# Altium project UCLA-DRS4-2.1.PrjPCB (part 4 of 7)

## Sheet TCA_CLK_DIST.SchDoc: My title
size A3; Organization: University of California; Address1: 475 Portola Plaza; Address2: Los Angeles, CA 90095; Revision: R01; SheetNumber: 1; SheetTotal: 1
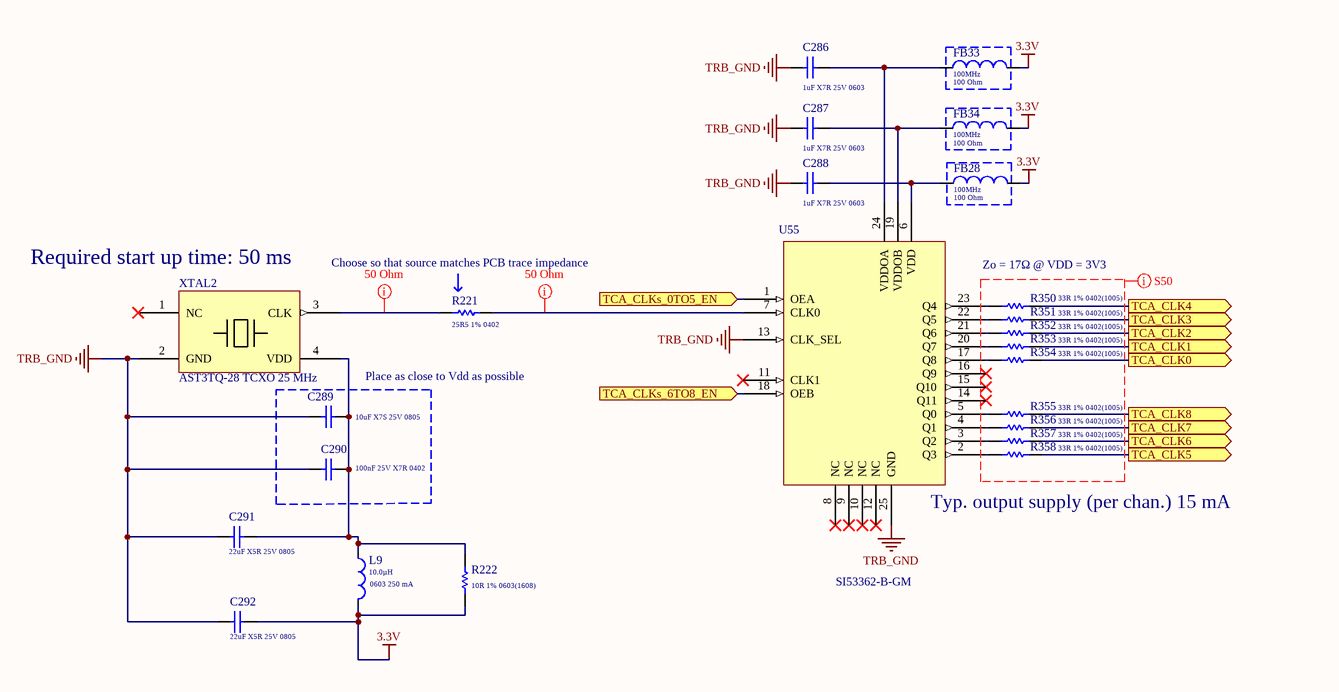
[diagram p11: TCA_CLK_DIST.SchDoc]

### Parts
C286  Capacitance: 1uF X7R 25V 0603  [Cap_Murata_GCJ188R71E105KA01J_1uF]  (hidden comment: Cap_Murata_GCJ188R71E105KA01J_1uF)
C287  Capacitance: 1uF X7R 25V 0603  [Cap_Murata_GCJ188R71E105KA01J_1uF]  (hidden comment: Cap_Murata_GCJ188R71E105KA01J_1uF)
C288  Capacitance: 1uF X7R 25V 0603  [Cap_Murata_GCJ188R71E105KA01J_1uF]  (hidden comment: Cap_Murata_GCJ188R71E105KA01J_1uF)
C289  Capacitance: 10uF X7S 25V 0805  [Cap_Murata_ GRM21BC71E106ME11L_10uF]  (hidden comment: Cap_Murata_ GRM21BC71E106ME11L_10uF)
C290  Capacitance: 100nF 25V X7R 0402  [Cap_Taiyo_Yuden_TMK105B7104KV-FR_100nF]  (hidden comment: Cap_Taiyo_Yuden_TMK105B7104KV-FR_100nF)
C291  Capacitance: 22uF X5R 25V 0805  [Cap_Murata_GRT21BR61E226ME13L_22uF]  (hidden comment: Cap_Murata_GRT21BR61E226ME13L_22uF)
C292  Capacitance: 22uF X5R 25V 0805  [Cap_Murata_GRT21BR61E226ME13L_22uF]  (hidden comment: Cap_Murata_GRT21BR61E226ME13L_22uF)
FB28  Measuring Frequency: 100MHz  Impedance: 100 Ohm  [FB_Wurth_Electronics_742792731_100Ohms]  (hidden comment: 742792731)
FB33  Measuring Frequency: 100MHz  Impedance: 100 Ohm  [FB_Wurth_Electronics_742792731_100Ohms]  (hidden comment: 742792731)
FB34  Measuring Frequency: 100MHz  Impedance: 100 Ohm  [FB_Wurth_Electronics_742792731_100Ohms]  (hidden comment: 742792731)
L9  0603 250 mA  Inductance: 10.0µH  [TDK_MLZ1608M100WT_0]
R221  25R5 1% 0402  [RESC0402(1005)_L]
R222  10R 1% 0603(1608)  [RESC0603(1608)_L]
R350  33R 1% 0402(1005)  [RESC0402(1005)_L]
R351  33R 1% 0402(1005)  [RESC0402(1005)_L]
R352  33R 1% 0402(1005)  [RESC0402(1005)_L]
R353  33R 1% 0402(1005)  [RESC0402(1005)_L]
R354  33R 1% 0402(1005)  [RESC0402(1005)_L]
R355  33R 1% 0402(1005)  [RESC0402(1005)_L]
R356  33R 1% 0402(1005)  [RESC0402(1005)_L]
R357  33R 1% 0402(1005)  [RESC0402(1005)_L]
R358  33R 1% 0402(1005)  [RESC0402(1005)_L]
U55  SI53362-B-GM  [Si53362]
XTAL2  AST3TQ-28 TCXO 25 MHz  [XTAL_ASDM1-25.000MHZ-LC-T]

### Blocks framed on the sheet
Place as close to Vdd as possible: C289 C290

### Ports
TCA_CLK0 (out), TCA_CLK1 (out), TCA_CLK2 (out), TCA_CLK3 (out), TCA_CLK4 (out), TCA_CLK5 (out), TCA_CLK6 (out), TCA_CLK7 (out), TCA_CLK8 (out), TCA_CLKs_0TO5_EN (in), TCA_CLKs_6TO8_EN (in)

### Nets
3.3V: C292.2 FB28.2 FB33.2 FB34.2 L9.2 R222.1
TRB_GND: C286.2 C287.2 C288.2 C289.1 C290.2 C291.1 C292.1 U55.13(CLK_SEL) U55.25(GND) XTAL2.2(GND)
TCA_CLK0: R354.2 ; port TCA_CLK0
TCA_CLK1: R353.2 ; port TCA_CLK1
TCA_CLK2: R352.2 ; port TCA_CLK2
TCA_CLK3: R351.2 ; port TCA_CLK3
TCA_CLK4: R350.2 ; port TCA_CLK4
TCA_CLK5: R358.2 ; port TCA_CLK5
TCA_CLK6: R357.2 ; port TCA_CLK6
TCA_CLK7: R356.2 ; port TCA_CLK7
TCA_CLK8: R355.2 ; port TCA_CLK8
TCA_CLK_0T05_EN: U55.1(OEA) ; port TCA_CLKs_0TO5_EN
TCA_CLK_6T08_EN: U55.18(OEB) ; port TCA_CLKs_6TO8_EN
NetC286_1: C286.1 FB33.1 U55.24(VDDOA)
NetC287_1: C287.1 FB34.1 U55.19(VDDOB)
NetC288_1: C288.1 FB28.1 U55.6(VDD)
NetC289_2: C289.2 C290.1 C291.2 L9.1 R222.2 XTAL2.4(VDD)
NetR221_1: R221.1 XTAL2.3(CLK)
NetR221_2: R221.2 U55.7(CLK0)
NetR350_1: R350.1 U55.23(Q4)
NetR351_1: R351.1 U55.22(Q5)
NetR352_1: R352.1 U55.21(Q6)
NetR353_1: R353.1 U55.20(Q7)
NetR354_1: R354.1 U55.17(Q8)
NetR355_1: R355.1 U55.5(Q0)
NetR356_1: R356.1 U55.4(Q1)
NetR357_1: R357.1 U55.3(Q2)
NetR358_1: R358.1 U55.2(Q3)

Not connected (* = marked no-connect by the designer): U55 8(NC)* 9(NC)* 10(NC)* 11(CLK1)* 12(NC)* 14(Q11)* 15(Q10)* 16(Q9)*; XTAL2 1(NC)*

### Layout directives
net class S50: (no net found under the mark)

### Notes on the sheet
- (near XTAL2) Required start up time: 50 ms
- Choose so that source matches PCB trace impedance
- Zo = 17Ω @ VDD = 3V3
- (near U55) Typ. output supply (per chan.) 15 mA
- 475 Portola Plaza
- GAPS TOF
- igarcia91@g.ucla.edu
- Los Angeles, CA
- 310-825-0344
- Size:
- Date:
- Letter
- Number:
- Time:
- Sheet
- Revision:
- of
- andrew.peck@cern.ch
- spq@ucla.edu
- File:

### Library data of the parts
C286-C288 = Cap_Murata_GCJ188R71E105KA01J_1uF: CAP CER 1uF 25V X7R 0603; Supplier 1: Mouser; Supplier Part Number 1: 81-GCJ188R71E105KA1J
C289 = Cap_Murata_ GRM21BC71E106ME11L_10uF: CAP CER 10uF 25V X7R 0805; Supplier 1: Mouser; Supplier Part Number 1: 81-GRM21BC71E106ME1L
C290 = Cap_Taiyo_Yuden_TMK105B7104KV-FR_100nF: CAP CER 100nF 25V X7R 0402; Supplier 1: Mouser; Supplier Part Number 1: 963-TMK105B7104KV-FR
C291 C292 = Cap_Murata_GRT21BR61E226ME13L_22uF: CAP CER 22uF 25V X5R 0805; Supplier 1: Mouser; Supplier Part Number 1: 81-GRT21BR61E226ME3L
FB28 FB33 FB34 = FB_Wurth_Electronics_742792731_100Ohms: FB SMD 100 OHM 25% 1.2A 0402; DC Resistance: 90mOhm; Supplier 1: Mouser; Supplier Part Number 1: 710-742792731
L9 = Ind_TDK_MLZ1608M100WT_eec: IND 10µH Shielded Multilayer Inductor 250mA 1.365 Ohm Max 0603 (1608 Metric); Manufacturer: TDK; Value: 10.0µH; Tolerance: ±20%; Part Number: MLZ1608M100WT; helpURL: https://upverter.com/upn/revision/22fa022ced0eb0ec/; ComponentLink2Description: Datasheet; Temperature: -55°C to +125°C; Package: 0603 (1608 metric); Supplier 2: Mouser; Supplier 1: Digi-Key; ComponentLink1URL: https://upverter.com/upn/revision/22fa022ced0eb0ec/; Supplier Part Number 2: 810-MLZ1608M100WT000; Supplier Part Number 1: 445-6389-1-ND; ComponentLink1Description: Upverter; ComponentLink2URL: https://product.tdk.com/info/en/catalog/datasheets/inductor_commercial_decoupling_mlz1608_en.pdf; RoHS: TRUE; Mouser Part Number: 810-MLZ1608M100WT000; Current Rating: 250mA; Ipc Land Pattern Name: CAPC16080X45; Temperature Range High: +125°C; Digikey Description: IND 10µH Shielded Multilayer Inductor 250mA 1.365 Ohm Max 0603 (1608 Metric); Digikey Part Number: 445-6389-1-ND; Lead Free: yes; Temperature Range Low: -55°C; DC Resistance (DCR): 1.365 Ohm Max
R221 = CMP-1011-00328-1: 25R5 0.063W 1% 0402 (1005 Metric)  SMD; Case-EIA: 0402; Case-Metric: 1005; Value: 25.50 Ohm; Tolerance: 1 %; Power: 0.063 W; Technology: SMT
R222 = CMP-1012-00284-1: 10R 0.1W 1% 0603 (1608 Metric)  SMD; Case-Metric: 1608; Case-EIA: 0603; Value: 10.00 Ohm; Tolerance: 1 %; Power: 0.1 W; Technology: SMT
R350-R358 = CMP-1011-00341-1: 33R 0.063W 1% 0402 (1005 Metric)  SMD; Case-Metric: 1005; Value: 33.00 Ohm; Case-EIA: 0402; Tolerance: 1 %; Power: 0.063 W; Technology: SMT
U55 = SI53362-B-GM: Clock Buffer LVCMOS 2:12 buffer (200MHz), 2:1 LVCMOS input max, output enable (QFN24); Supplier 1: Mouser; Supplier Part Number 1: 634-SI53362-B-GM
XTAL2 = AST3TQ-28: TCXO Oscillators 25MHz 3.3Volt LVCMOS 0.280 ppm -40C 85C; Supplier 1: Mouser; Supplier Part Number 1: 815-3TQ-T40-28

## Sheet TCA_LP_FILTER.SchDoc: My title
size A3; Organization: University of California; Address1: 475 Portola Plaza; Address2: Los Angeles, CA 90095; Revision: R01; SheetNumber: 1; SheetTotal: 1
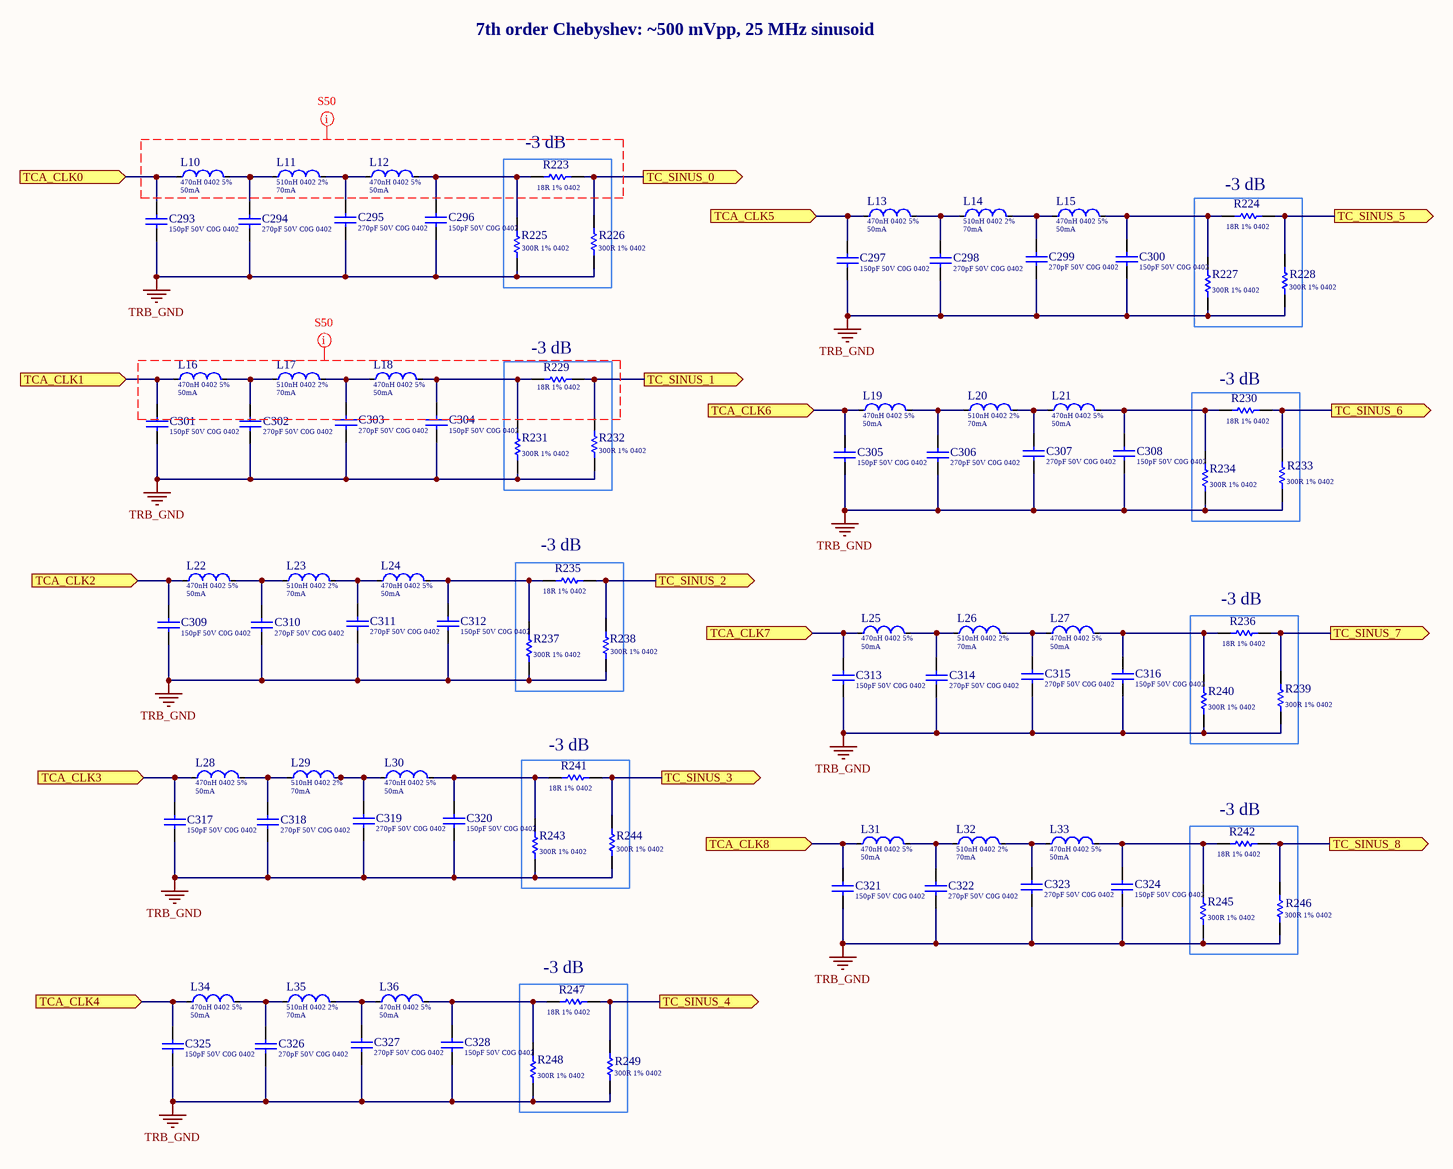
[diagram p12: TCA_LP_FILTER.SchDoc]

### Parts
C293  Capacitance: 150pF 50V C0G 0402  [Cap_TDK_CGA2B2C0G2A151J050BE_150pF]  (hidden comment: Cap_TDK_CGA2B2C0G2A151J050BE_150pF)
C294  Capacitance: 270pF 50V C0G 0402  [Cap_Murata_GCM1555C1H271FA16D_270pF]  (hidden comment: Cap_Murata_GCM1555C1H271FA16D_270pF)
C295  Capacitance: 270pF 50V C0G 0402  [Cap_Murata_GCM1555C1H271FA16D_270pF]  (hidden comment: Cap_Murata_GCM1555C1H271FA16D_270pF)
C296  Capacitance: 150pF 50V C0G 0402  [Cap_TDK_CGA2B2C0G2A151J050BE_150pF]  (hidden comment: Cap_TDK_CGA2B2C0G2A151J050BE_150pF)
C297  Capacitance: 150pF 50V C0G 0402  [Cap_TDK_CGA2B2C0G2A151J050BE_150pF]  (hidden comment: Cap_TDK_CGA2B2C0G2A151J050BE_150pF)
C298  Capacitance: 270pF 50V C0G 0402  [Cap_Murata_GCM1555C1H271FA16D_270pF]  (hidden comment: Cap_Murata_GCM1555C1H271FA16D_270pF)
C299  Capacitance: 270pF 50V C0G 0402  [Cap_Murata_GCM1555C1H271FA16D_270pF]  (hidden comment: Cap_Murata_GCM1555C1H271FA16D_270pF)
C300  Capacitance: 150pF 50V C0G 0402  [Cap_TDK_CGA2B2C0G2A151J050BE_150pF]  (hidden comment: Cap_TDK_CGA2B2C0G2A151J050BE_150pF)
C301  Capacitance: 150pF 50V C0G 0402  [Cap_TDK_CGA2B2C0G2A151J050BE_150pF]  (hidden comment: Cap_TDK_CGA2B2C0G2A151J050BE_150pF)
C302  Capacitance: 270pF 50V C0G 0402  [Cap_Murata_GCM1555C1H271FA16D_270pF]  (hidden comment: Cap_Murata_GCM1555C1H271FA16D_270pF)
C303  Capacitance: 270pF 50V C0G 0402  [Cap_Murata_GCM1555C1H271FA16D_270pF]  (hidden comment: Cap_Murata_GCM1555C1H271FA16D_270pF)
C304  Capacitance: 150pF 50V C0G 0402  [Cap_TDK_CGA2B2C0G2A151J050BE_150pF]  (hidden comment: Cap_TDK_CGA2B2C0G2A151J050BE_150pF)
C305  Capacitance: 150pF 50V C0G 0402  [Cap_TDK_CGA2B2C0G2A151J050BE_150pF]  (hidden comment: Cap_TDK_CGA2B2C0G2A151J050BE_150pF)
C306  Capacitance: 270pF 50V C0G 0402  [Cap_Murata_GCM1555C1H271FA16D_270pF]  (hidden comment: Cap_Murata_GCM1555C1H271FA16D_270pF)
C307  Capacitance: 270pF 50V C0G 0402  [Cap_Murata_GCM1555C1H271FA16D_270pF]  (hidden comment: Cap_Murata_GCM1555C1H271FA16D_270pF)
C308  Capacitance: 150pF 50V C0G 0402  [Cap_TDK_CGA2B2C0G2A151J050BE_150pF]  (hidden comment: Cap_TDK_CGA2B2C0G2A151J050BE_150pF)
C309  Capacitance: 150pF 50V C0G 0402  [Cap_TDK_CGA2B2C0G2A151J050BE_150pF]  (hidden comment: Cap_TDK_CGA2B2C0G2A151J050BE_150pF)
C310  Capacitance: 270pF 50V C0G 0402  [Cap_Murata_GCM1555C1H271FA16D_270pF]  (hidden comment: Cap_Murata_GCM1555C1H271FA16D_270pF)
C311  Capacitance: 270pF 50V C0G 0402  [Cap_Murata_GCM1555C1H271FA16D_270pF]  (hidden comment: Cap_Murata_GCM1555C1H271FA16D_270pF)
C312  Capacitance: 150pF 50V C0G 0402  [Cap_TDK_CGA2B2C0G2A151J050BE_150pF]  (hidden comment: Cap_TDK_CGA2B2C0G2A151J050BE_150pF)
C313  Capacitance: 150pF 50V C0G 0402  [Cap_TDK_CGA2B2C0G2A151J050BE_150pF]  (hidden comment: Cap_TDK_CGA2B2C0G2A151J050BE_150pF)
C314  Capacitance: 270pF 50V C0G 0402  [Cap_Murata_GCM1555C1H271FA16D_270pF]  (hidden comment: Cap_Murata_GCM1555C1H271FA16D_270pF)
C315  Capacitance: 270pF 50V C0G 0402  [Cap_Murata_GCM1555C1H271FA16D_270pF]  (hidden comment: Cap_Murata_GCM1555C1H271FA16D_270pF)
C316  Capacitance: 150pF 50V C0G 0402  [Cap_TDK_CGA2B2C0G2A151J050BE_150pF]  (hidden comment: Cap_TDK_CGA2B2C0G2A151J050BE_150pF)
C317  Capacitance: 150pF 50V C0G 0402  [Cap_TDK_CGA2B2C0G2A151J050BE_150pF]  (hidden comment: Cap_TDK_CGA2B2C0G2A151J050BE_150pF)
C318  Capacitance: 270pF 50V C0G 0402  [Cap_Murata_GCM1555C1H271FA16D_270pF]  (hidden comment: Cap_Murata_GCM1555C1H271FA16D_270pF)
C319  Capacitance: 270pF 50V C0G 0402  [Cap_Murata_GCM1555C1H271FA16D_270pF]  (hidden comment: Cap_Murata_GCM1555C1H271FA16D_270pF)
C320  Capacitance: 150pF 50V C0G 0402  [Cap_TDK_CGA2B2C0G2A151J050BE_150pF]  (hidden comment: Cap_TDK_CGA2B2C0G2A151J050BE_150pF)
C321  Capacitance: 150pF 50V C0G 0402  [Cap_TDK_CGA2B2C0G2A151J050BE_150pF]  (hidden comment: Cap_TDK_CGA2B2C0G2A151J050BE_150pF)
C322  Capacitance: 270pF 50V C0G 0402  [Cap_Murata_GCM1555C1H271FA16D_270pF]  (hidden comment: Cap_Murata_GCM1555C1H271FA16D_270pF)
C323  Capacitance: 270pF 50V C0G 0402  [Cap_Murata_GCM1555C1H271FA16D_270pF]  (hidden comment: Cap_Murata_GCM1555C1H271FA16D_270pF)
C324  Capacitance: 150pF 50V C0G 0402  [Cap_TDK_CGA2B2C0G2A151J050BE_150pF]  (hidden comment: Cap_TDK_CGA2B2C0G2A151J050BE_150pF)
C325  Capacitance: 150pF 50V C0G 0402  [Cap_TDK_CGA2B2C0G2A151J050BE_150pF]  (hidden comment: Cap_TDK_CGA2B2C0G2A151J050BE_150pF)
C326  Capacitance: 270pF 50V C0G 0402  [Cap_Murata_GCM1555C1H271FA16D_270pF]  (hidden comment: Cap_Murata_GCM1555C1H271FA16D_270pF)
C327  Capacitance: 270pF 50V C0G 0402  [Cap_Murata_GCM1555C1H271FA16D_270pF]  (hidden comment: Cap_Murata_GCM1555C1H271FA16D_270pF)
C328  Capacitance: 150pF 50V C0G 0402  [Cap_TDK_CGA2B2C0G2A151J050BE_150pF]  (hidden comment: Cap_TDK_CGA2B2C0G2A151J050BE_150pF)
L10  470nH 0402 5%  Current Rating: 50mA  [TDK_MLF1005GR47JT000_0]
L11  510nH 0402 2%  Current Rating: 70mA  [TDK_MHQ1005PR51GT000_0]
L12  470nH 0402 5%  Current Rating: 50mA  [TDK_MLF1005GR47JT000_0]
L13  470nH 0402 5%  Current Rating: 50mA  [TDK_MLF1005GR47JT000_0]
L14  510nH 0402 2%  Current Rating: 70mA  [TDK_MHQ1005PR51GT000_0]
L15  470nH 0402 5%  Current Rating: 50mA  [TDK_MLF1005GR47JT000_0]
L16  470nH 0402 5%  Current Rating: 50mA  [TDK_MLF1005GR47JT000_0]
L17  510nH 0402 2%  Current Rating: 70mA  [TDK_MHQ1005PR51GT000_0]
L18  470nH 0402 5%  Current Rating: 50mA  [TDK_MLF1005GR47JT000_0]
L19  470nH 0402 5%  Current Rating: 50mA  [TDK_MLF1005GR47JT000_0]
L20  510nH 0402 2%  Current Rating: 70mA  [TDK_MHQ1005PR51GT000_0]
L21  470nH 0402 5%  Current Rating: 50mA  [TDK_MLF1005GR47JT000_0]
L22  470nH 0402 5%  Current Rating: 50mA  [TDK_MLF1005GR47JT000_0]
L23  510nH 0402 2%  Current Rating: 70mA  [TDK_MHQ1005PR51GT000_0]
L24  470nH 0402 5%  Current Rating: 50mA  [TDK_MLF1005GR47JT000_0]
L25  470nH 0402 5%  Current Rating: 50mA  [TDK_MLF1005GR47JT000_0]
L26  510nH 0402 2%  Current Rating: 70mA  [TDK_MHQ1005PR51GT000_0]
L27  470nH 0402 5%  Current Rating: 50mA  [TDK_MLF1005GR47JT000_0]
L28  470nH 0402 5%  Current Rating: 50mA  [TDK_MLF1005GR47JT000_0]
L29  510nH 0402 2%  Current Rating: 70mA  [TDK_MHQ1005PR51GT000_0]
L30  470nH 0402 5%  Current Rating: 50mA  [TDK_MLF1005GR47JT000_0]
L31  470nH 0402 5%  Current Rating: 50mA  [TDK_MLF1005GR47JT000_0]
L32  510nH 0402 2%  Current Rating: 70mA  [TDK_MHQ1005PR51GT000_0]
L33  470nH 0402 5%  Current Rating: 50mA  [TDK_MLF1005GR47JT000_0]
L34  470nH 0402 5%  Current Rating: 50mA  [TDK_MLF1005GR47JT000_0]
L35  510nH 0402 2%  Current Rating: 70mA  [TDK_MHQ1005PR51GT000_0]
L36  470nH 0402 5%  Current Rating: 50mA  [TDK_MLF1005GR47JT000_0]
R223  18R 1% 0402  [RESC0402(1005)_L]
R224  18R 1% 0402  [RESC0402(1005)_L]
R225  300R 1% 0402  [RESC0402(1005)_L]
R226  300R 1% 0402  [RESC0402(1005)_L]
R227  300R 1% 0402  [RESC0402(1005)_L]
R228  300R 1% 0402  [RESC0402(1005)_L]
R229  18R 1% 0402  [RESC0402(1005)_L]
R230  18R 1% 0402  [RESC0402(1005)_L]
R231  300R 1% 0402  [RESC0402(1005)_L]
R232  300R 1% 0402  [RESC0402(1005)_L]
R233  300R 1% 0402  [RESC0402(1005)_L]
R234  300R 1% 0402  [RESC0402(1005)_L]
R235  18R 1% 0402  [RESC0402(1005)_L]
R236  18R 1% 0402  [RESC0402(1005)_L]
R237  300R 1% 0402  [RESC0402(1005)_L]
R238  300R 1% 0402  [RESC0402(1005)_L]
R239  300R 1% 0402  [RESC0402(1005)_L]
R240  300R 1% 0402  [RESC0402(1005)_L]
R241  18R 1% 0402  [RESC0402(1005)_L]
R242  18R 1% 0402  [RESC0402(1005)_L]
R243  300R 1% 0402  [RESC0402(1005)_L]
R244  300R 1% 0402  [RESC0402(1005)_L]
R245  300R 1% 0402  [RESC0402(1005)_L]
R246  300R 1% 0402  [RESC0402(1005)_L]
R247  18R 1% 0402  [RESC0402(1005)_L]
R248  300R 1% 0402  [RESC0402(1005)_L]
R249  300R 1% 0402  [RESC0402(1005)_L]

### Blocks framed on the sheet
-3 dB: R223 R225 R226
-3 dB: R224 R227 R228
-3 dB: R229 R231 R232
-3 dB: R230 R233 R234
-3 dB: R235 R237 R238
-3 dB: R236 R239 R240
-3 dB: R241 R243 R244
-3 dB: R242 R245 R246
-3 dB: R247-R249

### Ports
TC_SINUS_0 (out), TC_SINUS_1 (out), TC_SINUS_2 (out), TC_SINUS_3 (out), TC_SINUS_4 (out), TC_SINUS_5 (out), TC_SINUS_6 (out), TC_SINUS_7 (out), TC_SINUS_8 (out), TCA_CLK0 (in), TCA_CLK1 (in), TCA_CLK2 (in), TCA_CLK3 (in), TCA_CLK4 (in), TCA_CLK5 (in), TCA_CLK6 (in), TCA_CLK7 (in), TCA_CLK8 (in)

### Nets
TRB_GND: C293.1 C294.1 C295.1 C296.1 C297.1 C298.1 C299.1 C300.1 C301.1 C302.1 C303.1 C304.1 C305.1 C306.1 C307.1 C308.1 C309.1 C310.1 C311.1 C312.1 C313.1 C314.1 C315.1 C316.1 C317.1 C318.1 C319.1 C320.1 C321.1 C322.1 C323.1 C324.1 C325.1 C326.1 C327.1 C328.1 R225.1 R226.1 R227.1 R228.1 R231.1 R232.1 R233.1 R234.1 R237.1 R238.1 R239.1 R240.1 R243.1 R244.1 R245.1 R246.1 R248.1 R249.1
TC_0: R223.2 R226.2 ; port TC_SINUS_0
TC_1: R229.2 R232.2 ; port TC_SINUS_1
TC_2: R235.2 R238.2 ; port TC_SINUS_2
TC_3: R241.2 R244.2 ; port TC_SINUS_3
TC_4: R247.2 R249.2 ; port TC_SINUS_4
TC_5: R224.2 R228.2 ; port TC_SINUS_5
TC_6: R230.2 R233.2 ; port TC_SINUS_6
TC_7: R236.2 R239.2 ; port TC_SINUS_7
TC_8: R242.2 R246.2 ; port TC_SINUS_8
TCA_CLK0: C293.2 L10.1 ; port TCA_CLK0
TCA_CLK1: C301.2 L16.1 ; port TCA_CLK1
TCA_CLK2: C309.2 L22.1 ; port TCA_CLK2
TCA_CLK3: C317.2 L28.1 ; port TCA_CLK3
TCA_CLK4: C325.2 L34.1 ; port TCA_CLK4
TCA_CLK5: C297.2 L13.1 ; port TCA_CLK5
TCA_CLK6: C305.2 L19.1 ; port TCA_CLK6
TCA_CLK7: C313.2 L25.1 ; port TCA_CLK7
TCA_CLK8: C321.2 L31.1 ; port TCA_CLK8
NetC294_2: C294.2 L10.2 L11.1
NetC295_2: C295.2 L11.2 L12.1
NetC296_2: C296.2 L12.2 R223.1 R225.2
NetC298_2: C298.2 L13.2 L14.1
NetC299_2: C299.2 L14.2 L15.1
NetC300_2: C300.2 L15.2 R224.1 R227.2
NetC302_2: C302.2 L16.2 L17.1
NetC303_2: C303.2 L17.2 L18.1
NetC304_2: C304.2 L18.2 R229.1 R231.2
NetC306_2: C306.2 L19.2 L20.1
NetC307_2: C307.2 L20.2 L21.1
NetC308_2: C308.2 L21.2 R230.1 R234.2
NetC310_2: C310.2 L22.2 L23.1
NetC311_2: C311.2 L23.2 L24.1
NetC312_2: C312.2 L24.2 R235.1 R237.2
NetC314_2: C314.2 L25.2 L26.1
NetC315_2: C315.2 L26.2 L27.1
NetC316_2: C316.2 L27.2 R236.1 R240.2
NetC318_2: C318.2 L28.2 L29.1
NetC319_2: C319.2 L29.2 L30.1
NetC320_2: C320.2 L30.2 R241.1 R243.2
NetC322_2: C322.2 L31.2 L32.1
NetC323_2: C323.2 L32.2 L33.1
NetC324_2: C324.2 L33.2 R242.1 R245.2
NetC326_2: C326.2 L34.2 L35.1
NetC327_2: C327.2 L35.2 L36.1
NetC328_2: C328.2 L36.2 R247.1 R248.2

### Layout directives
net class S50: (no net found under the mark)

### Notes on the sheet
- 7th order Chebyshev: ~500 mVpp, 25 MHz sinusoid
- 475 Portola Plaza
- GAPS TOF
- igarcia91@g.ucla.edu
- Los Angeles, CA
- 310-825-0344
- Size:
- Date:
- Letter
- Number:
- Time:
- Sheet
- Revision:
- of
- andrew.peck@cern.ch
- spq@ucla.edu
- File:

### Library data of the parts
C293 C296 C297 C300 C301 C304 C305 C308 C309 C312 C313 C316 C317 C320 C321 C324 C325 C328 = Cap_TDK_CGA2B2C0G2A151J050BE_150pF: CAP 150pF 50V C0G ±1% 0402 (1000 Metric) Thickness 1mm SMD; Supplier 1: Mouser; Supplier Part Number 1: 810-CGA2B2C0G2A151J0
C294 C295 C298 C299 C302 C303 C306 C307 C310 C311 C314 C315 C318 C319 C322 C323 C326 C327 = Cap_Murata_GCM1555C1H271FA16D_270pF: CAP 270pF 50V C0G ±1% 0402; Supplier 1: Mouser; Supplier Part Number 1: 81-GCM1555C1H271FA6D
L10 L12 L13 L15 L16 L18 L19 L21 L22 L24 L25 L27 L28 L30 L31 L33 L34 L36 = Ind_TDK_MLF1005GR47JT000: IND 470nH Shielded Multilayer Inductor 50mA 420 mOhm Max 0402 (1005 Metric); Manufacturer: TDK; Value: 270.0nH; DC Resistance (DCR): 420mOhms; Part Number: MLF1005GR47JT000; ComponentLink2Description: Datasheet; Temperature: -55°C to +125°C; ComponentLink2URL: https://product.tdk.com/info/en/catalog/datasheets/inductor_commercial_decoupling_mlz1608_en.pdf; RoHS: TRUE; Temperature Range High: +125°C; Lead Free: yes; Temperature Range Low: -55°C; Tolerance: ±5%; Package: 0402 (1005); Inductance: 470nH; Supplier 1: Mouser; Supplier Part Number 1: 810-MLF1005GR47JT000
L11 L14 L17 L20 L23 L26 L29 L32 L35 = Ind_TDK_MHQ1005PR51GT000: IND 510nH Shielded Multilayer Inductor 70mA 10.2 Ohm Max 0402 (1005 Metric); Manufacturer: TDK; Value: 510.0nH; DC Resistance (DCR): 10.2Ohms; Part Number: MHQ1005PR51GT000; ComponentLink2Description: Datasheet; Temperature: -55°C to +125°C; ComponentLink2URL: https://product.tdk.com/info/en/catalog/datasheets/inductor_commercial_decoupling_mlz1608_en.pdf; RoHS: TRUE; Temperature Range High: +125°C; Lead Free: yes; Temperature Range Low: -55°C; Tolerance: ±2%; Package: 0402 (1005); Inductance: 510nH; Supplier Part Number 1: 810-MHQ1005PR51GT000; Supplier 1: Mouser
R223 R224 R229 R230 R235 R236 R241 R242 R247 = CMP-1011-00311-1: 18R 0.063W 1% 0402 (1005 Metric)  SMD; Case-EIA: 0402; Value: 18.00 Ohm; Case-Metric: 1005; Tolerance: 1 %; Power: 0.063 W; Technology: SMT
R225-R228 R231-R234 R237-R240 R243-R246 R248 R249 = CMP-1011-00449-1: 300R 0.063W 1% 0402 (1005 Metric)  SMD; Case-EIA: 0402; Value: 300.00 Ohm; Case-Metric: 1005; Tolerance: 1 %; Technology: SMT; Power: 0.063 W

## Sheet MARS_MIO.SchDoc: My title
size A3; Organization: University of California; Address1: 475 Portola Plaza; Address2: Los Angeles, CA 90095; Revision: R01; SheetNumber: 1; SheetTotal: 1
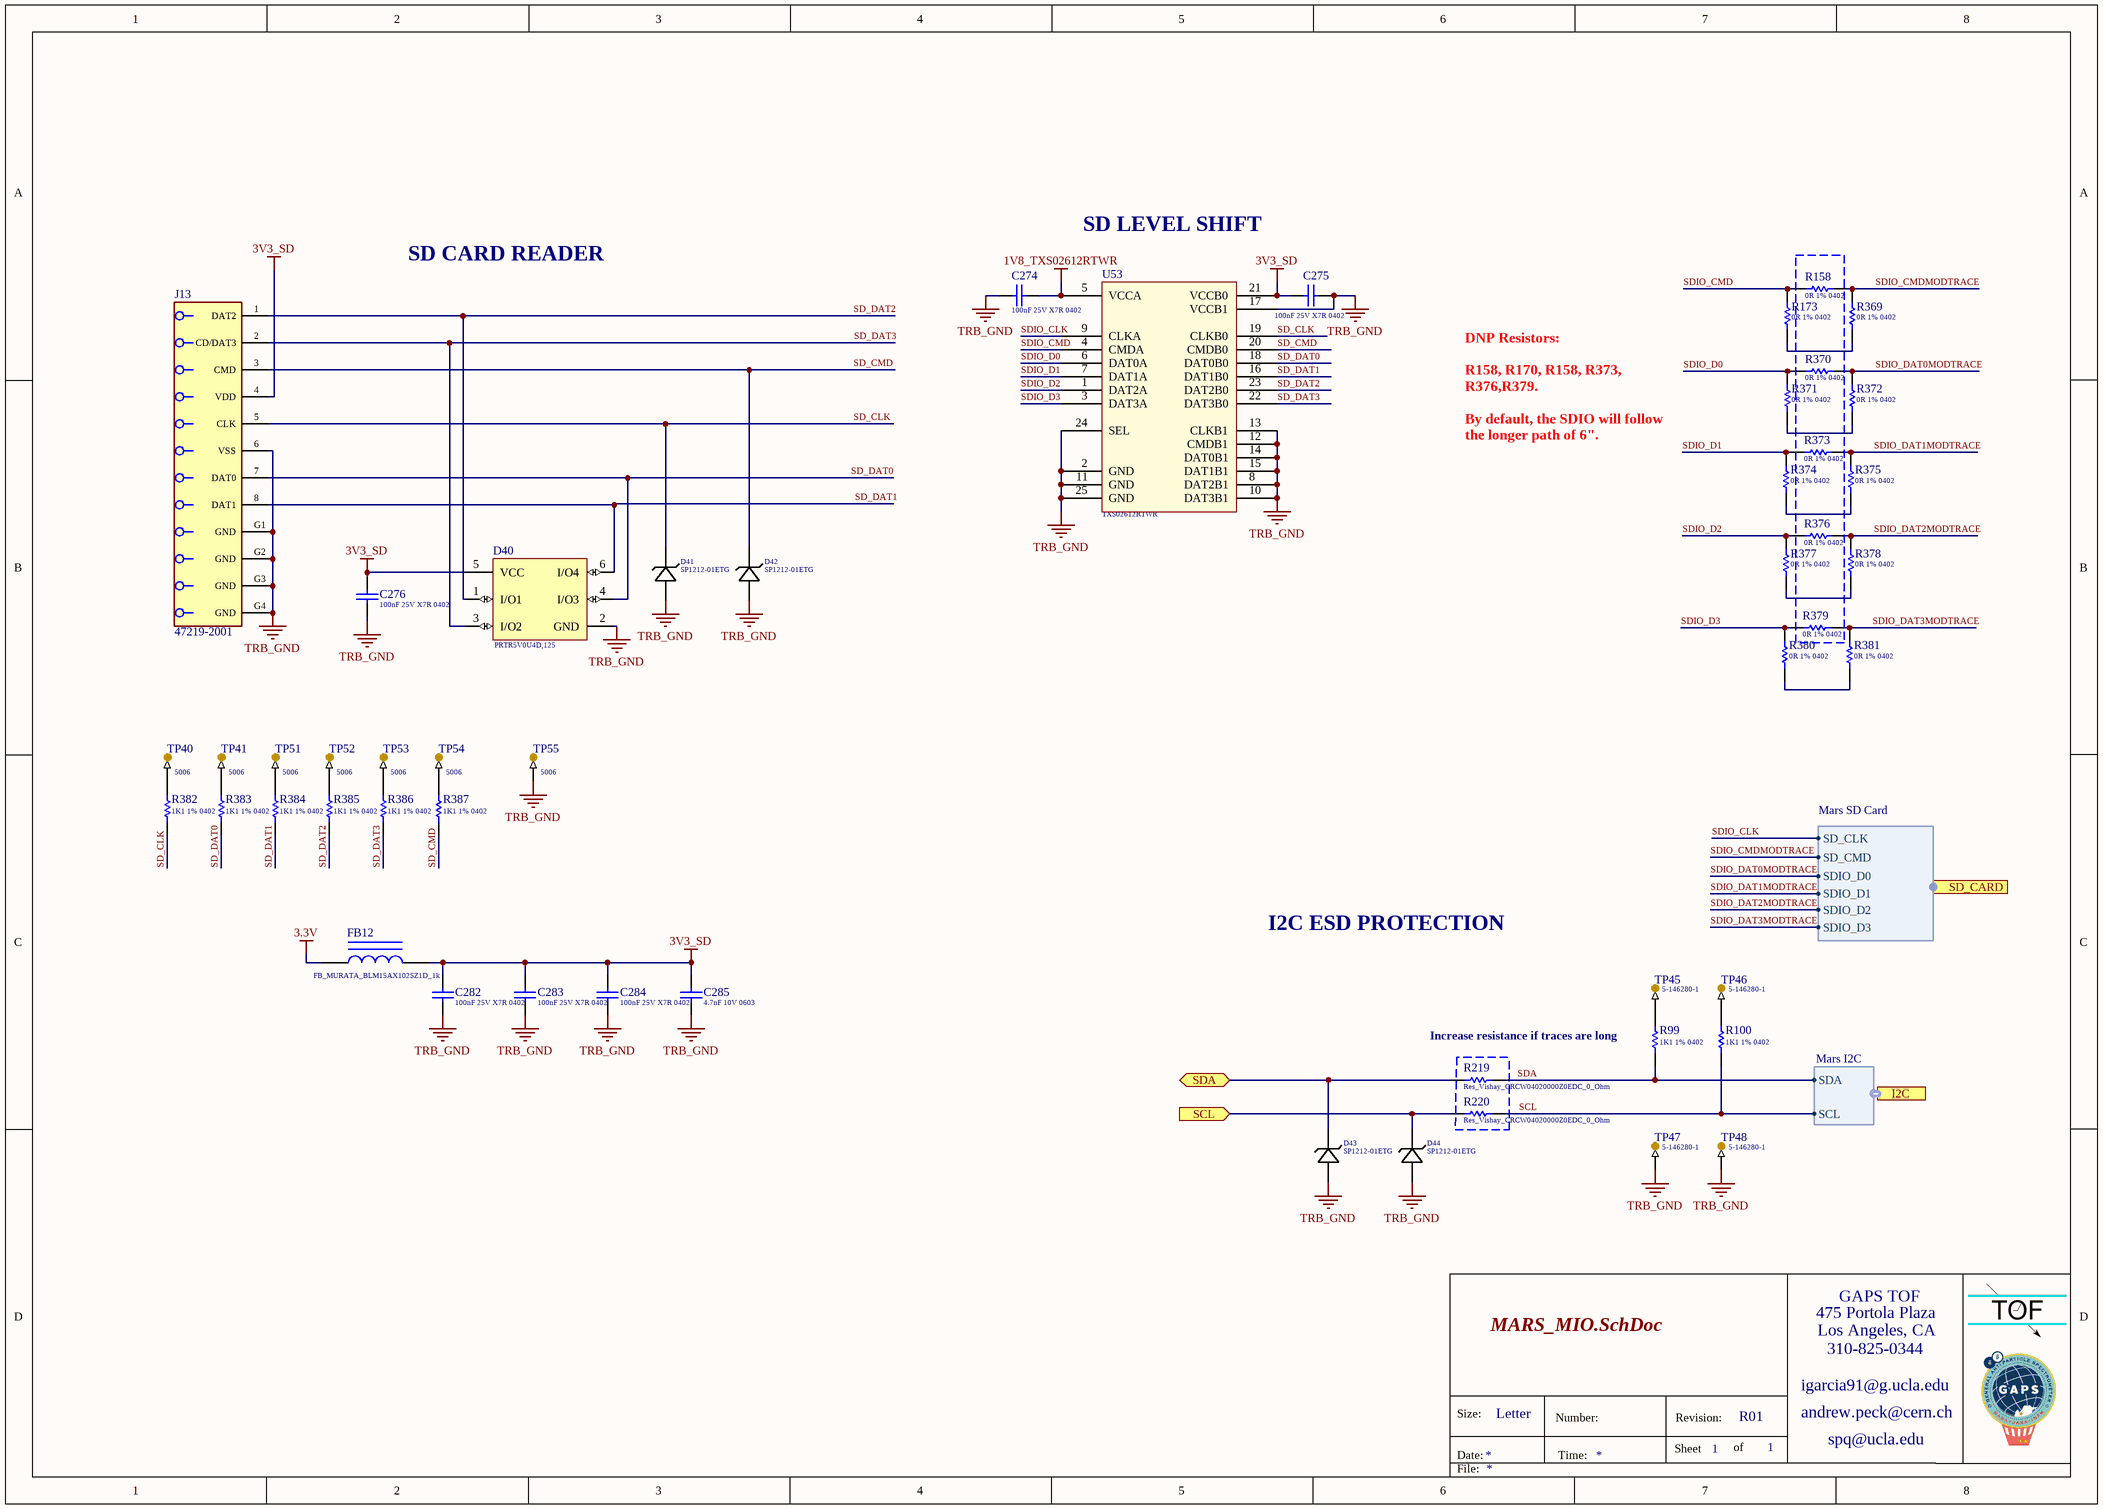
[diagram p13: MARS_MIO.SchDoc]

### Parts
C274  Capacitance: 100nF 25V X7R 0402  [Cap_Taiyo_Yuden_TMK105B7104KV-FR_100nF]  (hidden comment: Cap_Taiyo_Yuden_TMK105B7104KV-FR_100nF)
C275  Capacitance: 100nF 25V X7R 0402  [Cap_Taiyo_Yuden_TMK105B7104KV-FR_100nF]  (hidden comment: Cap_Taiyo_Yuden_TMK105B7104KV-FR_100nF)
C276  Capacitance: 100nF 25V X7R 0402  [Cap_Taiyo_Yuden_TMK105B7104KV-FR_100nF]  (hidden comment: Cap_Taiyo_Yuden_TMK105B7104KV-FR_100nF)
C282  Capacitance: 100nF 25V X7R 0402  [Cap_Taiyo_Yuden_TMK105B7104KV-FR_100nF]  (hidden comment: Cap_Taiyo_Yuden_TMK105B7104KV-FR_100nF)
C283  Capacitance: 100nF 25V X7R 0402  [Cap_Taiyo_Yuden_TMK105B7104KV-FR_100nF]  (hidden comment: Cap_Taiyo_Yuden_TMK105B7104KV-FR_100nF)
C284  Capacitance: 100nF 25V X7R 0402  [Cap_Taiyo_Yuden_TMK105B7104KV-FR_100nF]  (hidden comment: Cap_Taiyo_Yuden_TMK105B7104KV-FR_100nF)
C285  4.7nF 10V 0603  [CAPC0603(1608)100_L]
D40  PRTR5V0U4D,125  [PRTR5V0U4D,125]
D41  Series: SP1212-01ETG  [5V_ESD_Littlefuse_SP1212-01ETG_30kV]  (hidden comment: 5V_ESD_Littlefuse_SP1212-01ETG_30kV)
D42  Series: SP1212-01ETG  [5V_ESD_Littlefuse_SP1212-01ETG_30kV]  (hidden comment: 5V_ESD_Littlefuse_SP1212-01ETG_30kV)
D43  Series: SP1212-01ETG  [5V_ESD_Littlefuse_SP1212-01ETG_30kV]  (hidden comment: 5V_ESD_Littlefuse_SP1212-01ETG_30kV)
D44  Series: SP1212-01ETG  [5V_ESD_Littlefuse_SP1212-01ETG_30kV]  (hidden comment: 5V_ESD_Littlefuse_SP1212-01ETG_30kV)
FB12  FB_MURATA_BLM15AX102SZ1D_1k  [FB_MURATA_BLM15AX102SZ1D_1k]
J13  Part Number: 47219-2001  [Molex_47219-2001_0]  (hidden comment: Conn_Molex_47219-2001_eec)
R99  1K1 1% 0402  [RESC0402(1005)_L]
R100  1K1 1% 0402  [RESC0402(1005)_L]
R158  Resistance: 0R 1% 0402  [Res_Vishay_CRCW04020000Z0EDC_0_Ohm]  (hidden comment: Res_Vishay_CRCW04020000Z0EDC_0_Ohm)
R173  Resistance: 0R 1% 0402  [Res_Vishay_CRCW04020000Z0EDC_0_Ohm]  (hidden comment: Res_Vishay_CRCW04020000Z0EDC_0_Ohm)
R219  Res_Vishay_CRCW04020000Z0EDC_0_Ohm  [Res_Vishay_CRCW04020000Z0EDC_0_Ohm]
R220  Res_Vishay_CRCW04020000Z0EDC_0_Ohm  [Res_Vishay_CRCW04020000Z0EDC_0_Ohm]
R369  Resistance: 0R 1% 0402  [Res_Vishay_CRCW04020000Z0EDC_0_Ohm]  (hidden comment: Res_Vishay_CRCW04020000Z0EDC_0_Ohm)
R370  Resistance: 0R 1% 0402  [Res_Vishay_CRCW04020000Z0EDC_0_Ohm]  (hidden comment: Res_Vishay_CRCW04020000Z0EDC_0_Ohm)
R371  Resistance: 0R 1% 0402  [Res_Vishay_CRCW04020000Z0EDC_0_Ohm]  (hidden comment: Res_Vishay_CRCW04020000Z0EDC_0_Ohm)
R372  Resistance: 0R 1% 0402  [Res_Vishay_CRCW04020000Z0EDC_0_Ohm]  (hidden comment: Res_Vishay_CRCW04020000Z0EDC_0_Ohm)
R373  Resistance: 0R 1% 0402  [Res_Vishay_CRCW04020000Z0EDC_0_Ohm]  (hidden comment: Res_Vishay_CRCW04020000Z0EDC_0_Ohm)
R374  Resistance: 0R 1% 0402  [Res_Vishay_CRCW04020000Z0EDC_0_Ohm]  (hidden comment: Res_Vishay_CRCW04020000Z0EDC_0_Ohm)
R375  Resistance: 0R 1% 0402  [Res_Vishay_CRCW04020000Z0EDC_0_Ohm]  (hidden comment: Res_Vishay_CRCW04020000Z0EDC_0_Ohm)
R376  Resistance: 0R 1% 0402  [Res_Vishay_CRCW04020000Z0EDC_0_Ohm]  (hidden comment: Res_Vishay_CRCW04020000Z0EDC_0_Ohm)
R377  Resistance: 0R 1% 0402  [Res_Vishay_CRCW04020000Z0EDC_0_Ohm]  (hidden comment: Res_Vishay_CRCW04020000Z0EDC_0_Ohm)
R378  Resistance: 0R 1% 0402  [Res_Vishay_CRCW04020000Z0EDC_0_Ohm]  (hidden comment: Res_Vishay_CRCW04020000Z0EDC_0_Ohm)
R379  Resistance: 0R 1% 0402  [Res_Vishay_CRCW04020000Z0EDC_0_Ohm]  (hidden comment: Res_Vishay_CRCW04020000Z0EDC_0_Ohm)
R380  Resistance: 0R 1% 0402  [Res_Vishay_CRCW04020000Z0EDC_0_Ohm]  (hidden comment: Res_Vishay_CRCW04020000Z0EDC_0_Ohm)
R381  Resistance: 0R 1% 0402  [Res_Vishay_CRCW04020000Z0EDC_0_Ohm]  (hidden comment: Res_Vishay_CRCW04020000Z0EDC_0_Ohm)
R382  1K1 1% 0402  [RESC0402(1005)_L]
R383  1K1 1% 0402  [RESC0402(1005)_L]
R384  1K1 1% 0402  [RESC0402(1005)_L]
R385  1K1 1% 0402  [RESC0402(1005)_L]
R386  1K1 1% 0402  [RESC0402(1005)_L]
R387  1K1 1% 0402  [RESC0402(1005)_L]
TP40  Series: 5006  [TP_Keystone_Electronics_5006]  (hidden comment: TP_Keystone_Electronics_5006)
TP41  Series: 5006  [TP_Keystone_Electronics_5006]  (hidden comment: TP_Keystone_Electronics_5006)
TP45  Series: 5-146280-1  [TP_TE_Connectivity_5-146280-1_1POS]  (hidden comment: TP_TE_Connectivity_5-146280-1_1POS)
TP46  Series: 5-146280-1  [TP_TE_Connectivity_5-146280-1_1POS]  (hidden comment: TP_TE_Connectivity_5-146280-1_1POS)
TP47  Series: 5-146280-1  [TP_TE_Connectivity_5-146280-1_1POS]  (hidden comment: TP_TE_Connectivity_5-146280-1_1POS)
TP48  Series: 5-146280-1  [TP_TE_Connectivity_5-146280-1_1POS]  (hidden comment: TP_TE_Connectivity_5-146280-1_1POS)
TP51  Series: 5006  [TP_Keystone_Electronics_5006]  (hidden comment: TP_Keystone_Electronics_5006)
TP52  Series: 5006  [TP_Keystone_Electronics_5006]  (hidden comment: TP_Keystone_Electronics_5006)
TP53  Series: 5006  [TP_Keystone_Electronics_5006]  (hidden comment: TP_Keystone_Electronics_5006)
TP54  Series: 5006  [TP_Keystone_Electronics_5006]  (hidden comment: TP_Keystone_Electronics_5006)
TP55  Series: 5006  [TP_Keystone_Electronics_5006]  (hidden comment: TP_Keystone_Electronics_5006)
U53  Series: TXS02612RTWR  [IC_TXS02612RTWR_SD_Level_Shifter]  (hidden comment: IC_TXS02612RTWR_SD_Level_Shifter)

### Ports
I2C (harness Mars I2C), SCL (in), SD_CARD (harness Mars SD Card), SDA (bidir)

### Harnesses
Mars SD Card: SDIO_D2, SDIO_D1, SDIO_D0, SD_CMD, SD_CLK, SDIO_D3
Mars I2C: SCL, SDA

### Nets
1V8_TXS02612RTWR: C274.1 U53.5(VCCA)
3.3V: FB12.1
3V3_SD: C275.2 C276.2 C282.2 C283.2 C284.2 C285.1 D40.5(VCC) FB12.2 J13.4(VDD) U53.21(VCCB0)
TRB_GND: C274.2 C275.1 C276.1 C282.1 C283.1 C284.1 C285.2 D40.2(GND) D41.2 D42.2 D43.2 D44.2 J13.6(VSS) J13.G1(GND) J13.G2(GND) J13.G3(GND) J13.G4(GND) TP47.1 TP48.1 TP55.1 U53.2(GND) U53.8(DAT2B1) U53.10(DAT3B1) U53.11(GND) U53.12(CMDB1) U53.13(CLKB1) U53.14(DAT0B1) U53.15(DAT1B1) U53.17(VCCB1) U53.24(SEL) U53.25(GND)
I2C_SCL: D44.1 R220.2 ; port SCL
I2C_SDA: D43.1 R219.2 ; port SDA
SCL: R100.1 R220.1 ; port I2C.SCL
SD_CLK: D41.1 J13.5(CLK) R382.1 U53.19(CLKB0)
SD_CMD: D42.1 J13.3(CMD) R387.1 U53.20(CMDB0)
SD_DAT0: D40.4(I/O3) J13.7(DAT0) R383.1 U53.18(DAT0B0)
SD_DAT1: D40.6(I/O4) J13.8(DAT1) R384.1 U53.16(DAT1B0)
SD_DAT2: D40.1(I/O1) J13.1(DAT2) R385.1 U53.23(DAT2B0)
SD_DAT3: D40.3(I/O2) J13.2(CD/DAT3) R386.1 U53.22(DAT3B0)
SDA: R99.1 R219.1 ; port I2C.SDA
SDIO_CLK: U53.9(CLKA) ; port SD_CARD.SD_CLK
SDIO_CMD: R158.1 R173.2 U53.4(CMDA)
SDIO_CMDMODTRACE: R158.2 R369.2 ; port SD_CARD.SD_CMD  [project net IO_MIO41_B13_L16_W9]
SDIO_D0: R370.1 R371.2 U53.6(DAT0A)
SDIO_D1: R373.1 R374.2 U53.7(DAT1A)
SDIO_D2: R376.1 R377.2 U53.1(DAT2A)
SDIO_D3: R379.1 R380.2 U53.3(DAT3A)
SDIO_DAT0MODTRACE: R370.2 R372.2 ; port SD_CARD.SDIO_D0  [project net IO_MIO42_B13_L18_W11]
SDIO_DAT1MODTRACE: R373.2 R375.2 ; port SD_CARD.SDIO_D1  [project net IO_MIO43_B13_L18_Y11]
SDIO_DAT2MODTRACE: R376.2 R378.2 ; port SD_CARD.SDIO_D2  [project net IO_MIO44_B13_L14_SRCC_Y9]
SDIO_DAT3MODTRACE: R379.2 R381.2 ; port SD_CARD.SDIO_D3  [project net IO_MIO45_B13_L14_Y8]
NetR99_2: R99.2 TP45.1
NetR100_2: R100.2 TP46.1
NetR173_1: R173.1 R369.1
NetR371_1: R371.1 R372.1
NetR374_1: R374.1 R375.1
NetR377_1: R377.1 R378.1
NetR380_1: R380.1 R381.1
NetR382_2: R382.2 TP40.1
NetR383_2: R383.2 TP41.1
NetR384_2: R384.2 TP51.1
NetR385_2: R385.2 TP52.1
NetR386_2: R386.2 TP53.1
NetR387_2: R387.2 TP54.1

### Notes on the sheet
- SD LEVEL SHIFT
- SD CARD READER
- DNP Resistors:
  R158, R170, R158, R373, R376,R379.
  By default, the SDIO will follow the longer path of 6".
- I2C ESD PROTECTION
- (near R99) Increase resistance if traces are long
- 475 Portola Plaza
- GAPS TOF
- igarcia91@g.ucla.edu
- Los Angeles, CA
- 310-825-0344
- Size:
- Date:
- Letter
- Number:
- Time:
- Sheet
- Revision:
- of
- andrew.peck@cern.ch
- spq@ucla.edu
- File:

### Library data of the parts
C274-C276 C282-C284 = Cap_Taiyo_Yuden_TMK105B7104KV-FR_100nF: CAP CER 100nF 25V X7R 0402; Supplier 1: Mouser; Supplier Part Number 1: 963-TMK105B7104KV-FR
C285 = CMP-1035-02189-1: CAP 4.7nF 10V ±10% 0603 (1608 Metric) Thickness 1mm SMD; Case-Metric: 1608; Tolerance: Â±10%; Case-EIA: 0603; Max Thickness: 1 mm; Technology: SMT; Rated Voltage: 10 V; Value: 4.7nF
D40 = PRTR5V0U4D,125: ESD Suppressors / TVS Diodes 5.5V QUAD R-R ESD ULTRA LOW CAP; Supplier 1: Mouser; Supplier Part Number 1: 771-PRTR5V0U4D-T/R
D41-D44 = 5V_ESD_Littlefuse_SP1212-01ETG_30kV: ESD Suppressors / TVS Diodes 5V 12A 30KV UNI-DIR; Supplier 1: Mouser; Supplier Part Number 1: 576-SP1212-01ETG
FB12 = FB_MURATA_BLM15AX102SZ1D_1k: FB SMD 1000 OHM 25% 3/4W 0402; Supplier Part Number 1: 81-BLM15AX102SZ1D; Supplier 1: Mouser
J13 = Conn_Molex_47219-2001_eec: CONN MICRO SD CARD HINGED TYPE; Manufacturer: Molex; Is Female: yes; helpURL: https://upverter.com/upn/revision/cf639670a30b6b80/; ComponentLink2Description: Datasheet; Temperature: -20°C to +85°C; Package: SMT_SDCARD_14MM5_13MM6; Supplier 2: Mouser; Supplier 1: Digi-Key; ComponentLink1URL: https://upverter.com/upn/revision/cf639670a30b6b80/; Supplier Part Number 2: 538-47219-2001; Supplier Part Number 1: WM6698CT-ND; ComponentLink1Description: Upverter; ComponentLink2URL: http://www.molex.com/pdm_docs/sd/472192001_sd.pdf; RoHS: TRUE; Mouser Part Number: 538-47219-2001; Temperature Range High: +85°C; Digikey Description: CONN MICRO SD CARD HINGED TYPE; Digikey Part Number: WM6698CT-ND; Lead Free: yes; Temperature Range Low: -20°C
R99 R100 R382-R387 = CMP-1011-00514-1: 1K1 0.063W 1% 0402 (1005 Metric)  SMD; Case-Metric: 1005; Case-EIA: 0402; Value: 1100.00 Ohm; Power: 0.063 W; Tolerance: 1 %; Technology: SMT
R158 R173 R369-R381 = Res_Vishay_CRCW04020000Z0EDC_0_Ohm: 0R 0.062W 1% 0402 (1005 Metric)  SMD; Supplier 1: Mouser; Supplier Part Number 1: 71-CRCW04020000Z0EDC
R219 R220 = Res_Vishay_CRCW04020000Z0EDC_0_Ohm: 0R 0.062W 1% 0402 (1005 Metric)  SMD; Resistance: 0R 1% 0402; Supplier 1: Mouser; Supplier Part Number 1: 71-CRCW04020000Z0EDC
TP40 TP41 TP51-TP55 = TP_Keystone_Electronics_5006: as TP83-TP88 on sheet DAC; Supplier 1: Mouser; Supplier Part Number 1: 534-5006
TP45-TP48 = TP_TE_Connectivity_5-146280-1_1POS: Headers & Wire Housings Unshrouded 1 POS T/H; Supplier Part Number 1: 571-51462801; Supplier 1: Mouser
U53 = IC_TXS02612RTWR_SD_Level_Shifter: Interface - I/O Expanders SDIO Port Expander; Supplier Part Number 1: 595-TXS02612RTWR; Supplier 1: Mouser

## Sheet CLK_PWR.SchDoc: Clock power
size Letter; Organization: University of California; Address1: 475 Portola Plaza; Address2: Los Angeles, CA 90095; Revision: R01; SheetNumber: 10; SheetTotal: 32
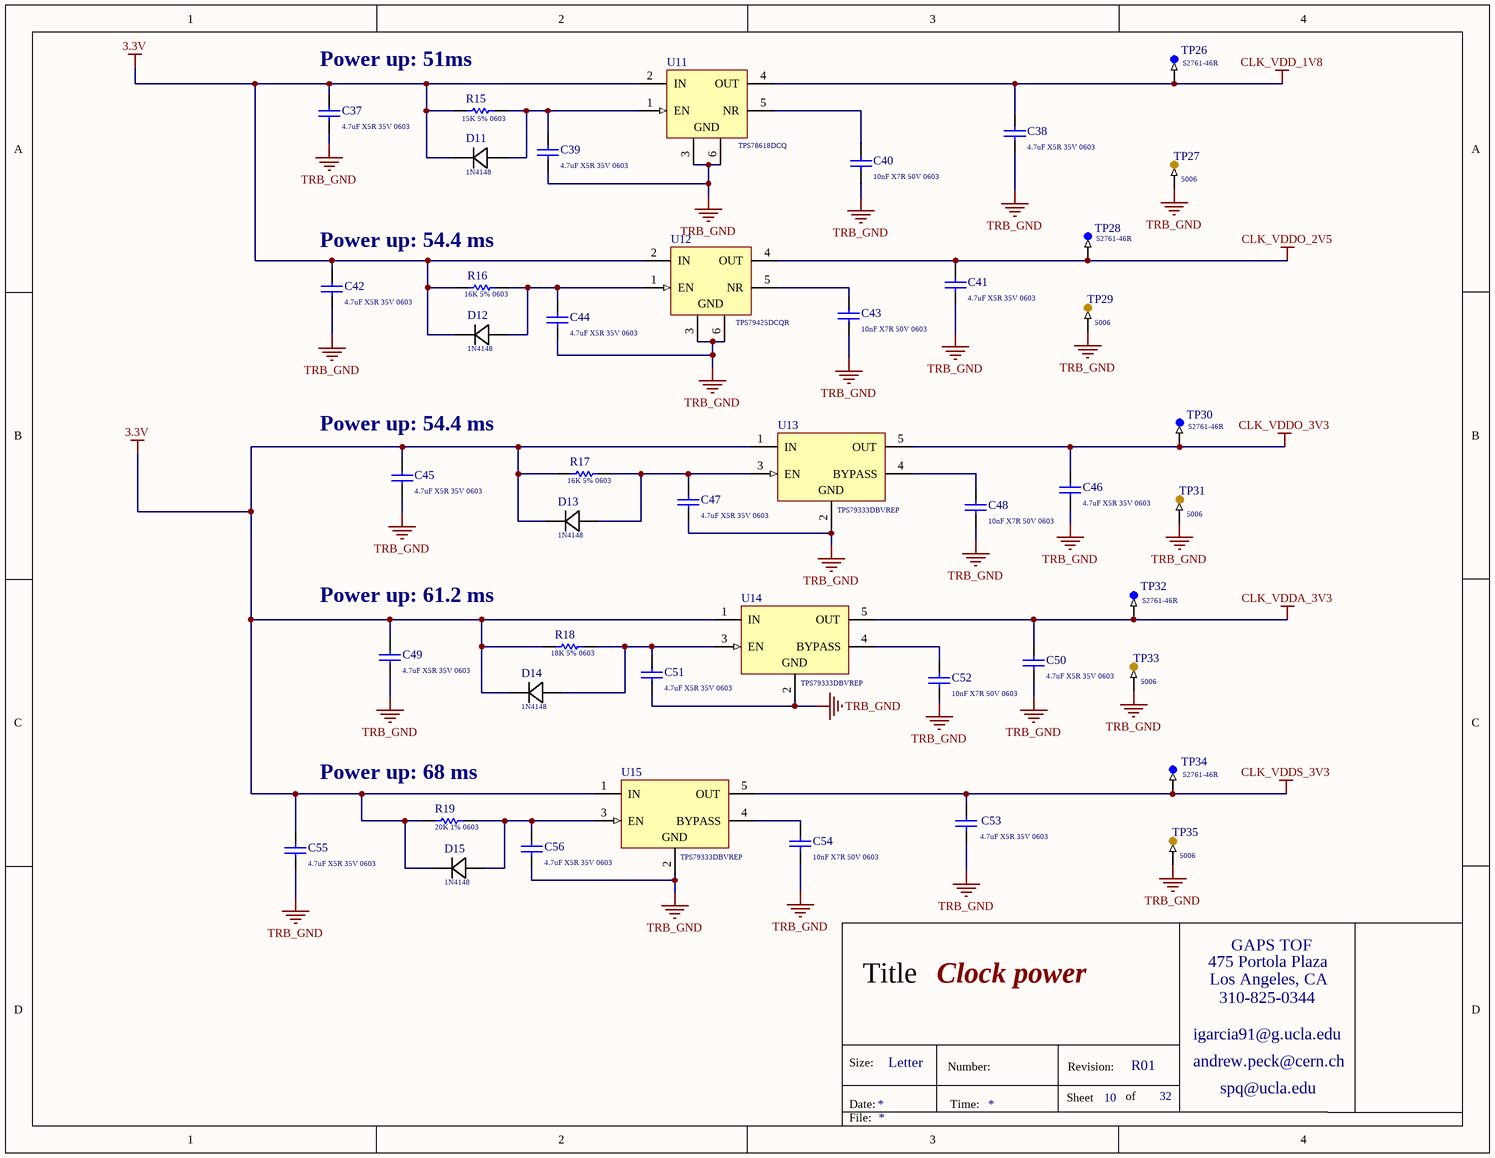
[diagram p14: CLK_PWR.SchDoc]

### Parts
C37  Capacitance: 4.7uF X5R 35V 0603  [Cap_Murata_ZRB18AR6YA475ME05L_4.7uF]  (hidden comment: Cap_Murata_ZRB18AR6YA475ME05L_4.7uF)
C38  Capacitance: 4.7uF X5R 35V 0603  [Cap_Murata_ZRB18AR6YA475ME05L_4.7uF]  (hidden comment: Cap_Murata_ZRB18AR6YA475ME05L_4.7uF)
C39  Capacitance: 4.7uF X5R 35V 0603  [Cap_Murata_ZRB18AR6YA475ME05L_4.7uF]  (hidden comment: Cap_Murata_ZRB18AR6YA475ME05L_4.7uF)
C40  Capacitance: 10nF X7R 50V 0603  [Kemet_C0603_0]  (hidden comment: Cap_Kemet_C0603C103J5RACTU_eec)
C41  Capacitance: 4.7uF X5R 35V 0603  [Cap_Murata_ZRB18AR6YA475ME05L_4.7uF]  (hidden comment: Cap_Murata_ZRB18AR6YA475ME05L_4.7uF)
C42  Capacitance: 4.7uF X5R 35V 0603  [Cap_Murata_ZRB18AR6YA475ME05L_4.7uF]  (hidden comment: Cap_Murata_ZRB18AR6YA475ME05L_4.7uF)
C43  Capacitance: 10nF X7R 50V 0603  [Kemet_C0603_0]  (hidden comment: Cap_Kemet_C0603C103J5RACTU_eec)
C44  Capacitance: 4.7uF X5R 35V 0603  [Cap_Murata_ZRB18AR6YA475ME05L_4.7uF]  (hidden comment: Cap_Murata_ZRB18AR6YA475ME05L_4.7uF)
C45  Capacitance: 4.7uF X5R 35V 0603  [Cap_Murata_ZRB18AR6YA475ME05L_4.7uF]  (hidden comment: Cap_Murata_ZRB18AR6YA475ME05L_4.7uF)
C46  Capacitance: 4.7uF X5R 35V 0603  [Cap_Murata_ZRB18AR6YA475ME05L_4.7uF]  (hidden comment: Cap_Murata_ZRB18AR6YA475ME05L_4.7uF)
C47  Capacitance: 4.7uF X5R 35V 0603  [Cap_Murata_ZRB18AR6YA475ME05L_4.7uF]  (hidden comment: Cap_Murata_ZRB18AR6YA475ME05L_4.7uF)
C48  Capacitance: 10nF X7R 50V 0603  [Kemet_C0603_0]  (hidden comment: Cap_Kemet_C0603C103J5RACTU_eec)
C49  Capacitance: 4.7uF X5R 35V 0603  [Cap_Murata_ZRB18AR6YA475ME05L_4.7uF]  (hidden comment: Cap_Murata_ZRB18AR6YA475ME05L_4.7uF)
C50  Capacitance: 4.7uF X5R 35V 0603  [Cap_Murata_ZRB18AR6YA475ME05L_4.7uF]  (hidden comment: Cap_Murata_ZRB18AR6YA475ME05L_4.7uF)
C51  Capacitance: 4.7uF X5R 35V 0603  [Cap_Murata_ZRB18AR6YA475ME05L_4.7uF]  (hidden comment: Cap_Murata_ZRB18AR6YA475ME05L_4.7uF)
C52  Capacitance: 10nF X7R 50V 0603  [Kemet_C0603_0]  (hidden comment: Cap_Kemet_C0603C103J5RACTU_eec)
C53  Capacitance: 4.7uF X5R 35V 0603  [Cap_Murata_ZRB18AR6YA475ME05L_4.7uF]  (hidden comment: Cap_Murata_ZRB18AR6YA475ME05L_4.7uF)
C54  Capacitance: 10nF X7R 50V 0603  [Kemet_C0603_0]  (hidden comment: Cap_Kemet_C0603C103J5RACTU_eec)
C55  Capacitance: 4.7uF X5R 35V 0603  [Cap_Murata_ZRB18AR6YA475ME05L_4.7uF]  (hidden comment: Cap_Murata_ZRB18AR6YA475ME05L_4.7uF)
C56  Capacitance: 4.7uF X5R 35V 0603  [Cap_Murata_ZRB18AR6YA475ME05L_4.7uF]  (hidden comment: Cap_Murata_ZRB18AR6YA475ME05L_4.7uF)
D11  Series: 1N4148  [Diode_ON_Semiconductor_1N4148WT_300mA]  (hidden comment: Diode_ON_Semiconductor_1N4148WT_300mA)
D12  Series: 1N4148  [Diode_ON_Semiconductor_1N4148WT_300mA]  (hidden comment: Diode_ON_Semiconductor_1N4148WT_300mA)
D13  Series: 1N4148  [Diode_ON_Semiconductor_1N4148WT_300mA]  (hidden comment: Diode_ON_Semiconductor_1N4148WT_300mA)
D14  Series: 1N4148  [Diode_ON_Semiconductor_1N4148WT_300mA]  (hidden comment: Diode_ON_Semiconductor_1N4148WT_300mA)
D15  Series: 1N4148  [Diode_ON_Semiconductor_1N4148WT_300mA]  (hidden comment: Diode_ON_Semiconductor_1N4148WT_300mA)
R15  15K 5% 0603  [RESC0603(1608)_L]
R16  16K 5% 0603  [RESC0603(1608)_L]
R17  16K 5% 0603  [RESC0603(1608)_L]
R18  18K 5% 0603  [RESC0603(1608)_L]
R19  20K 1% 0603  [RESC0603(1608)_L]
TP26  Series: S2761-46R  [TP_Harwin_S2761_46R]  (hidden comment: TP_Harwin_S2761_46R)
TP27  Series: 5006  [TP_Keystone_Electronics_5006]  (hidden comment: TP_Keystone_Electronics_5006)
TP28  Series: S2761-46R  [TP_Harwin_S2761_46R]  (hidden comment: TP_Harwin_S2761_46R)
TP29  Series: 5006  [TP_Keystone_Electronics_5006]  (hidden comment: TP_Keystone_Electronics_5006)
TP30  Series: S2761-46R  [TP_Harwin_S2761_46R]  (hidden comment: TP_Harwin_S2761_46R)
TP31  Series: 5006  [TP_Keystone_Electronics_5006]  (hidden comment: TP_Keystone_Electronics_5006)
TP32  Series: S2761-46R  [TP_Harwin_S2761_46R]  (hidden comment: TP_Harwin_S2761_46R)
TP33  Series: 5006  [TP_Keystone_Electronics_5006]  (hidden comment: TP_Keystone_Electronics_5006)
TP34  Series: S2761-46R  [TP_Harwin_S2761_46R]  (hidden comment: TP_Harwin_S2761_46R)
TP35  Series: 5006  [TP_Keystone_Electronics_5006]  (hidden comment: TP_Keystone_Electronics_5006)
U11  TPS78618DCQ  [DCQ0006A_L]
U12  TPS79425DCQR  [DCQ0006A_L]
U13  TPS79333DBVREP  [DBV0005A_M]
U14  TPS79333DBVREP  [DBV0005A_M]
U15  TPS79333DBVREP  [DBV0005A_M]

### Nets
3.3V: C37.2 C42.2 C45.2 C49.2 C55.2 D11.1 D12.1 D13.1 D14.1 D15.1 R15.1 R16.1 R17.1 R18.1 R19.2 U11.2(IN) U12.2(IN) U13.1(IN) U14.1(IN) U15.1(IN)
CLK_VDD_1V8: C38.2 TP26.1 U11.4(OUT)
CLK_VDDA_3V3: C50.2 TP32.1 U14.5(OUT)
CLK_VDDO_2V5: C41.2 TP28.1 U12.4(OUT)
CLK_VDDO_3V3: C46.2 TP30.1 U13.5(OUT)
CLK_VDDS_3V3: C53.2 TP34.1 U15.5(OUT)
TRB_GND: C37.1 C38.1 C39.1 C40.2 C41.1 C42.1 C43.2 C44.1 C45.1 C46.1 C47.1 C48.2 C49.1 C50.1 C51.1 C52.2 C53.1 C54.2 C55.1 C56.1 TP27.1 TP29.1 TP31.1 TP33.1 TP35.1 U11.3(GND) U11.6(GND) U12.3(GND) U12.6(GND) U13.2(GND) U14.2(GND) U15.2(GND)
NetC39_2: C39.2 D11.2 R15.2 U11.1(EN)
NetC40_1: C40.1 U11.5(NR)
NetC43_1: C43.1 U12.5(NR)
NetC44_2: C44.2 D12.2 R16.2 U12.1(EN)
NetC47_2: C47.2 D13.2 R17.2 U13.3(EN)
NetC48_1: C48.1 U13.4(BYPASS)
NetC51_2: C51.2 D14.2 R18.2 U14.3(EN)
NetC52_1: C52.1 U14.4(BYPASS)
NetC54_1: C54.1 U15.4(BYPASS)
NetC56_2: C56.2 D15.2 R19.1 U15.3(EN)

### Notes on the sheet
- Power up: 51ms
- Power up: 54.4 ms
- (near C45) Power up: 54.4 ms
- Power up: 61.2 ms
- (near R19) Power up: 68 ms
- 475 Portola Plaza
- GAPS TOF
- Title
- igarcia91@g.ucla.edu
- Los Angeles, CA
- 310-825-0344
- Size:
- Date:
- Letter
- Number:
- Time:
- Sheet
- Revision:
- of
- andrew.peck@cern.ch
- spq@ucla.edu
- File:

### Library data of the parts
C37-C39 C41 C42 C44-C47 C49-C51 C53 C55 C56 = Cap_Murata_ZRB18AR6YA475ME05L_4.7uF: CAP CER 4.7uF 35V X5R 0603; Supplier 1: Mouser; Supplier Part Number 1: 81-ZRB18AR6YA475ME5L
C40 C43 C48 C52 C54 = Cap_Kemet_C0603C103J5RACTU_eec: CAP CER 10nF 50V X7R 0603; Manufacturer: Kemet; Mfg Package Ident: C0603; Part Number: C0603C103J5RACTU; helpURL: https://upverter.com/upn/revision/8a8d0c297e33ac74/; ComponentLink2Description: Datasheet; Temperature: -55°C to +125°C; Package: C0603; Supplier 2: Mouser; Price: 0.0184203126773; Supplier 1: Digi-Key; ComponentLink1URL: https://upverter.com/upn/revision/8a8d0c297e33ac74/; Supplier Part Number 2: 80-C0603C103J5R; Supplier Part Number 1: 399-1092-1-ND; Value: 10nF; ComponentLink1Description: Upverter; ComponentLink2URL: https://content.kemet.com/datasheets/KEM_C1002_X7R_SMD.pdf; RoHS: TRUE; Mouser Part Number: 80-C0603C103J5R; Temperature Range High: +125°C; Digikey Description: CAP CER 10000PF 50V X7R 0603; Digikey Part Number: 399-1092-1-ND; Lead Free: yes; Temperature Range Low: -55°C; Voltage: 50V
D11-D15 = Diode_ON_Semiconductor_1N4148WT_300mA: Diodes - General Purpose, Power, Switching SINGLE JUNC. 75V 4.0NS COMP; Supplier 1: Mouser; Supplier Part Number 1: 512-1N4148WT
R15 = CMP-1012-00102-1: 15K 0.1W 5% 0603 (1608 Metric)  SMD; Value: 15000.00 Ohm; Case-Metric: 1608; Case-EIA: 0603; Power: 0.1 W; Technology: SMT; Tolerance: 5 %
R16 R17 = CMP-1012-00103-1: 16K 0.1W 5% 0603 (1608 Metric)  SMD; Value: 16000.00 Ohm; Case-EIA: 0603; Case-Metric: 1608; Tolerance: 5 %; Technology: SMT; Power: 0.1 W
R18 = CMP-1012-00104-1: 18K 0.1W 5% 0603 (1608 Metric)  SMD; Case-Metric: 1608; Case-EIA: 0603; Value: 18000.00 Ohm; Technology: SMT; Power: 0.1 W; Tolerance: 5 %
R19 = CMP-1012-00655-1: 20K 0.1W 1% 0603 (1608 Metric)  SMD; Case-Metric: 1608; Case-EIA: 0603; Value: 20000.00 Ohm; Technology: SMT; Tolerance: 1 %; Power: 0.1 W
TP26 TP28 TP30 TP32 TP34 = TP_Harwin_S2761_46R: Circuit Board Hardware - PCB SMT Mini Test Terminal, Reel; Supplier 1: Newark; Supplier Part Number 1: 76Y5391
TP27 TP29 TP31 TP33 TP35 = TP_Keystone_Electronics_5006: Circuit Board Hardware - PCB TEST POINT BLK .063; Supplier 1: Mouser; Supplier Part Number 1: 534-5006
U11 = CMP-0395-00376-2: Single Output High PSRR LDO, 1.5 A, Fixed 1.8 V Output, 2.7 to 5.5 V Input, 6-pin SOT-223 (DCQ), -40 to 125 degC, Green (RoHS & no Sb/Br); Manufacturer: Texas Instruments; Accuracy(%): 3; Fixed Output Options(V): 1.8; Vin(Min)(V): 2.7; SubFamily: Single Channel LDO; Vdo(Typ)(mV): 390; Vin(Max)(V): 5.5; Iout(Max)(A): 1.5; Iq(Typ)(mA): 0.2; Vout Adj(Min)(V): 1.8; ComponentLink3Description: Package Specification; PackageReference: DCQ0006A; ComponentLink3URL: http://www.ti.com/litv/pdf/mpds098c; ComponentLink1Description: Manufacturer URL; DatasheetVersion: SLVS389L; PackageDescription: 6-Pin Plastic Small Outline, Body 3.5 x 6.5 mm, Pitch 1.27 mm; Vout Adj(Max)(V): 1.8; ComponentLink1URL: http://www.ti.com/; Eco-Plan: Green (RoHS & no Sb/Br); Mounting Technology: Surface Mount; PartNumber: TPS78618DCQ; PackageVersion: 4202109/D; ComponentLink2URL: http://www.ti.com/general/docs/lit/getliterature.tsp?genericPartNumber=TPS78618&fileType=pdf; ComponentLink2Description: Datasheet
U12 = CMP-0394-00936-2: Single Output High PSRR LDO, 250 mA, Fixed 2.5 V Output, 2.7 to 5.5 V Input, 6-pin SOT-223 (DCQ), -40 to 85 degC, Green (RoHS & no Sb/Br); Manufacturer: Texas Instruments; SubFamily: Single Channel LDO; Iout(Max)(A): 0.25; Vin(Max)(V): 5.5; Vin(Min)(V): 2.7; Fixed Output Options(V): 2.5; Vdo(Typ)(mV): 155; Iq(Typ)(mA): 0.26; Accuracy(%): 3; ComponentLink3Description: Package Specification; Mounting Technology: Surface Mount; ComponentLink1URL: http://www.ti.com/; PackageVersion: 4202109/D; ComponentLink2URL: http://www.ti.com/general/docs/lit/getliterature.tsp?genericPartNumber=TPS79425&fileType=pdf; DatasheetVersion: SLVS349E; Eco-Plan: Green (RoHS & no Sb/Br); PackageReference: DCQ0006A; PackageDescription: 6-Pin Plastic Small Outline, Body 3.5 x 6.5 mm, Pitch 1.27 mm; Vout Adj(Min)(V): 2.5; ComponentLink1Description: Manufacturer URL; Vout Adj(Max)(V): 2.5; ComponentLink3URL: http://www.ti.com/litv/pdf/mpds098c; ComponentLink2Description: Datasheet; PartNumber: TPS79425DCQR
U13-U15 = CMP-0394-00316-2: Single Output Fast RF LDO, 200 mA, Fixed 3.3 V Output, 2.7 to 5.5 V Input, 5-pin SOT-23 (DBV), -40 to 125 degC, Green (RoHS & no Sb/Br); Manufacturer: Texas Instruments; Accuracy(%): 2; SubFamily: Single Channel LDO; Vin(Max)(V): 5.5; Fixed Output Options(V): 3.3; Vdo(Typ)(mV): 102; Iout(Max)(A): 0.2; Rating: HiRel Enhanced Product; Vin(Min)(V): 2.7; DatasheetVersion: SGLS163B; PackageVersion: 4073253-4/K; Code_JEDEC: MO-178; PackageDescription: 5-Pin Plastic Small Outline, Body 1.60 Ãƒâ€” 2.90 mm, Pitch 0.95 mm; ComponentLink1Description: Manufacturer URL; ComponentLink1URL: http://www.ti.com/; ComponentLink2Description: Datasheet; ComponentLink2URL: http://www.ti.com/general/docs/lit/getliterature.tsp?genericPartNumber=TPS79333-EP&fileType=pdf; ComponentLink3URL: http://www.ti.com/litv/pdf/mpds018i; Mounting Technology: Surface Mount; PartNumber: TPS79333DBVREP; Vout Adj(Min)(V): 3.3; PackageReference: DBV0005A; Iq(Typ)(mA): 0.2; Vout Adj(Max)(V): 3.3; Eco-Plan: Green (RoHS & no Sb/Br); ComponentLink3Description: Package Specification

## Sheet 2V5_DRS4_SUPPLY.SchDoc: My title
size A3; Organization: University of California; Address1: 475 Portola Plaza; Address2: Los Angeles, CA 90095; Revision: R01; SheetNumber: 1; SheetTotal: 1
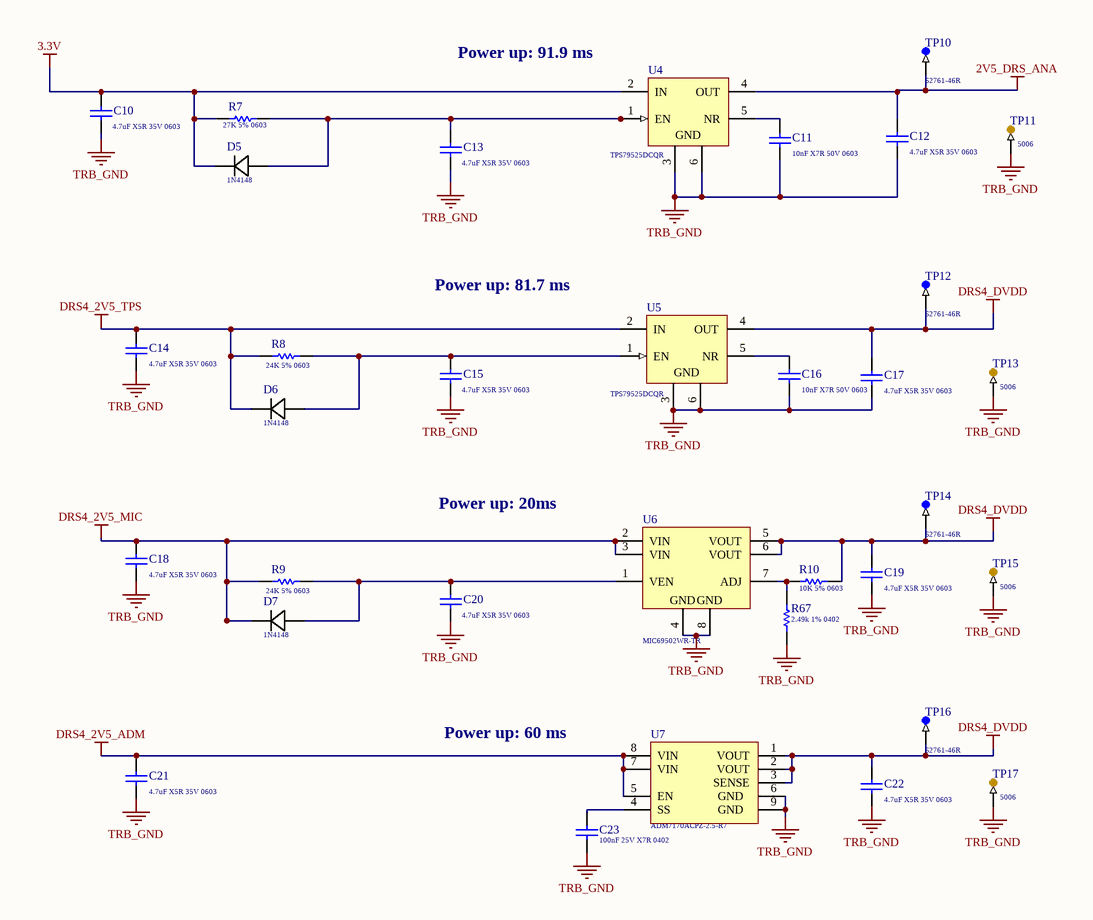
[diagram p15: 2V5_DRS4_SUPPLY.SchDoc]

### Parts
C10  Capacitance: 4.7uF X5R 35V 0603  [Cap_Murata_ZRB18AR6YA475ME05L_4.7uF]  (hidden comment: Cap_Murata_ZRB18AR6YA475ME05L_4.7uF)
C11  Capacitance: 10nF X7R 50V 0603  [Kemet_C0603_0]  (hidden comment: Cap_Kemet_C0603C103J5RACTU_eec)
C12  Capacitance: 4.7uF X5R 35V 0603  [Cap_Murata_ZRB18AR6YA475ME05L_4.7uF]  (hidden comment: Cap_Murata_ZRB18AR6YA475ME05L_4.7uF)
C13  Capacitance: 4.7uF X5R 35V 0603  [Cap_Murata_ZRB18AR6YA475ME05L_4.7uF]  (hidden comment: Cap_Murata_ZRB18AR6YA475ME05L_4.7uF)
C14  Capacitance: 4.7uF X5R 35V 0603  [Cap_Murata_ZRB18AR6YA475ME05L_4.7uF]  (hidden comment: Cap_Murata_ZRB18AR6YA475ME05L_4.7uF)
C15  Capacitance: 4.7uF X5R 35V 0603  [Cap_Murata_ZRB18AR6YA475ME05L_4.7uF]  (hidden comment: Cap_Murata_ZRB18AR6YA475ME05L_4.7uF)
C16  Capacitance: 10nF X7R 50V 0603  [Kemet_C0603_0]  (hidden comment: Cap_Kemet_C0603C103J5RACTU_eec)
C17  Capacitance: 4.7uF X5R 35V 0603  [Cap_Murata_ZRB18AR6YA475ME05L_4.7uF]  (hidden comment: Cap_Murata_ZRB18AR6YA475ME05L_4.7uF)
C18  Capacitance: 4.7uF X5R 35V 0603  [Cap_Murata_ZRB18AR6YA475ME05L_4.7uF]  (hidden comment: Cap_Murata_ZRB18AR6YA475ME05L_4.7uF)
C19  Capacitance: 4.7uF X5R 35V 0603  [Cap_Murata_ZRB18AR6YA475ME05L_4.7uF]  (hidden comment: Cap_Murata_ZRB18AR6YA475ME05L_4.7uF)
C20  Capacitance: 4.7uF X5R 35V 0603  [Cap_Murata_ZRB18AR6YA475ME05L_4.7uF]  (hidden comment: Cap_Murata_ZRB18AR6YA475ME05L_4.7uF)
C21  Capacitance: 4.7uF X5R 35V 0603  [Cap_Murata_ZRB18AR6YA475ME05L_4.7uF]  (hidden comment: Cap_Murata_ZRB18AR6YA475ME05L_4.7uF)
C22  Capacitance: 4.7uF X5R 35V 0603  [Cap_Murata_ZRB18AR6YA475ME05L_4.7uF]  (hidden comment: Cap_Murata_ZRB18AR6YA475ME05L_4.7uF)
C23  Capacitance: 100nF 25V X7R 0402  [Cap_Taiyo_Yuden_TMK105B7104KV-FR_100nF]  (hidden comment: Cap_Taiyo_Yuden_TMK105B7104KV-FR_100nF)
D5  Series: 1N4148  [Diode_ON_Semiconductor_1N4148WT_300mA]  (hidden comment: Diode_ON_Semiconductor_1N4148WT_300mA)
D6  Series: 1N4148  [Diode_ON_Semiconductor_1N4148WT_300mA]  (hidden comment: Diode_ON_Semiconductor_1N4148WT_300mA)
D7  Series: 1N4148  [Diode_ON_Semiconductor_1N4148WT_300mA]  (hidden comment: Diode_ON_Semiconductor_1N4148WT_300mA)
R7  27K 5% 0603  [RESC0603(1608)_L]
R8  24K 5% 0603  [RESC0603(1608)_L]
R9  24K 5% 0603  [RESC0603(1608)_L]
R10  10K 5% 0603  [RESC0603(1608)_L]
R67  Resistance: 2.49k 1% 0402  [Res_Yageo_RC0402FR-132K49L_2.48kOhm]  (hidden comment: Res_Yageo_RC0402FR-132K49L_2.48kOhm)
TP10  Series: S2761-46R  [TP_Harwin_S2761_46R]  (hidden comment: TP_Harwin_S2761_46R)
TP11  Series: 5006  [TP_Keystone_Electronics_5006]  (hidden comment: TP_Keystone_Electronics_5006)
TP12  Series: S2761-46R  [TP_Harwin_S2761_46R]  (hidden comment: TP_Harwin_S2761_46R)
TP13  Series: 5006  [TP_Keystone_Electronics_5006]  (hidden comment: TP_Keystone_Electronics_5006)
TP14  Series: S2761-46R  [TP_Harwin_S2761_46R]  (hidden comment: TP_Harwin_S2761_46R)
TP15  Series: 5006  [TP_Keystone_Electronics_5006]  (hidden comment: TP_Keystone_Electronics_5006)
TP16  Series: S2761-46R  [TP_Harwin_S2761_46R]  (hidden comment: TP_Harwin_S2761_46R)
TP17  Series: 5006  [TP_Keystone_Electronics_5006]  (hidden comment: TP_Keystone_Electronics_5006)
U4  TPS79525DCQR  [DCQ0006A_N]
U5  TPS79525DCQR  [DCQ0006A_N]
U6  Series: MIC69502WR-TR  [LDO_Microchip_MIC69502WR-TR_ADJ]  (hidden comment: LDO_Microchip_MIC69502WR-TR_ADJ)
U7  Series: ADM7170ACPZ-2.5-R7  [LDO_Analog_Devices_ADM7170ACPZ-2.5-R7_2.5V]  (hidden comment: LDO_Analog_Devices_ADM7170ACPZ-2.5-R7_2.5V)

### Nets
2V5_DRS_ANA: C12.2 TP10.1 U4.4(OUT)
3.3V: C10.2 D5.1 R7.1 U4.2(IN)
DRS4_2V5_ADM: C21.2 U7.5(EN) U7.7(VIN) U7.8(VIN)
DRS4_2V5_MIC: C18.2 D7.1 R9.1 U6.2(VIN) U6.3(VIN)
DRS4_2V5_TPS: C14.2 D6.1 R8.1 U5.2(IN)
DRS4_DVDD: C17.2 C19.2 C22.2 R10.2 TP12.1 TP14.1 TP16.1 U5.4(OUT) U6.5(VOUT) U6.6(VOUT) U7.1(VOUT) U7.2(VOUT) U7.3(SENSE)
TRB_GND: C10.1 C11.2 C12.1 C13.1 C14.1 C15.1 C16.2 C17.1 C18.1 C19.1 C20.1 C21.1 C22.1 C23.1 R67.1 TP11.1 TP13.1 TP15.1 TP17.1 U4.3(GND) U4.6(GND) U5.3(GND) U5.6(GND) U6.4(GND) U6.8(GND) U7.6(GND) U7.9(GND)
NetC11_1: C11.1 U4.5(NR)
NetC13_2: C13.2 D5.2 R7.2 U4.1(EN)
NetC15_2: C15.2 D6.2 R8.2 U5.1(EN)
NetC16_1: C16.1 U5.5(NR)
NetC20_2: C20.2 D7.2 R9.2 U6.1(VEN)
NetC23_2: C23.2 U7.4(SS)
NetR10_1: R10.1 R67.2 U6.7(ADJ)

### Notes on the sheet
- Power up: 91.9 ms
- Power up: 81.7 ms
- Power up: 20ms
- Power up: 60 ms
- 475 Portola Plaza
- GAPS TOF
- igarcia91@g.ucla.edu
- Los Angeles, CA
- 310-825-0344
- Size:
- Date:
- Letter
- Number:
- Time:
- Sheet
- Revision:
- of
- andrew.peck@cern.ch
- spq@ucla.edu
- File:

### Library data of the parts
C10 C12-C15 C17-C22 = Cap_Murata_ZRB18AR6YA475ME05L_4.7uF: CAP CER 4.7uF 35V X5R 0603; Supplier 1: Mouser; Supplier Part Number 1: 81-ZRB18AR6YA475ME5L
C11 C16 = Cap_Kemet_C0603C103J5RACTU_eec: as C40 on sheet CLK_PWR; Part Number: C0603C103J5RACTU; helpURL: https://upverter.com/upn/revision/8a8d0c297e33ac74/; ComponentLink2Description: Datasheet; Temperature: -55°C to +125°C; Package: C0603; Supplier 2: Mouser; Price: 0.0184203126773; Supplier 1: Digi-Key; ComponentLink1URL: https://upverter.com/upn/revision/8a8d0c297e33ac74/; Supplier Part Number 2: 80-C0603C103J5R; Supplier Part Number 1: 399-1092-1-ND; Value: 10nF; ComponentLink1Description: Upverter; ComponentLink2URL: https://content.kemet.com/datasheets/KEM_C1002_X7R_SMD.pdf; RoHS: TRUE; Mouser Part Number: 80-C0603C103J5R; Temperature Range High: +125°C; Digikey Description: CAP CER 10000PF 50V X7R 0603; Digikey Part Number: 399-1092-1-ND; Lead Free: yes; Temperature Range Low: -55°C; Voltage: 50V
C23 = Cap_Taiyo_Yuden_TMK105B7104KV-FR_100nF: CAP CER 100nF 25V X7R 0402; Supplier 1: Mouser; Supplier Part Number 1: 963-TMK105B7104KV-FR
D5-D7 = Diode_ON_Semiconductor_1N4148WT_300mA: as D11 on sheet CLK_PWR; Supplier 1: Mouser; Supplier Part Number 1: 512-1N4148WT
R7 = CMP-1012-00108-1: 27K 0.1W 5% 0603 (1608 Metric)  SMD; Value: 27000.00 Ohm; Case-Metric: 1608; Case-EIA: 0603; Power: 0.1 W; Tolerance: 5 %; Technology: SMT
R8 R9 = CMP-1012-00107-1: 24K 0.1W 5% 0603 (1608 Metric)  SMD; Case-Metric: 1608; Case-EIA: 0603; Value: 24000.00 Ohm; Tolerance: 5 %; Technology: SMT; Power: 0.1 W
R10 = CMP-1012-00098-1: 10K 0.1W 5% 0603 (1608 Metric)  SMD; Case-EIA: 0603; Value: 10000.00 Ohm; Case-Metric: 1608; Technology: SMT; Tolerance: 5 %; Power: 0.1 W
R67 = Res_Yageo_RC0402FR-132K49L_2.48kOhm: Thick Film Resistors - SMD 2.49K ohm 1% 50V General Purpose; Supplier Part Number 1: 603-RC0402FR-132K49L; Supplier 1: Mouser
TP10 TP12 TP14 TP16 = TP_Harwin_S2761_46R: as TP26 on sheet CLK_PWR; Supplier 1: Newark; Supplier Part Number 1: 76Y5391
TP11 TP13 TP15 TP17 = TP_Keystone_Electronics_5006: as TP27 on sheet CLK_PWR; Supplier 1: Mouser; Supplier Part Number 1: 534-5006
U4 U5 = TPS79525DCQR: Single Output High PSRR LDO, 500 mA, Fixed 2.5 V Output, 2.7 to 5.5 V Input, 6-pin SOT-223 (DCQ), -40 to 125 degC, Green (RoHS & no Sb/Br); Manufacturer: Texas Instruments; Accuracy(%): 2; Iq(Typ)(mA): 0.26; Vin(Min)(V): 2.7; Vout Adj(Min)(V): 2.5; SubFamily: Single Channel LDO; Vin(Max)(V): 5.5; Rating: Catalog; Iout(Max)(A): 0.5; Vdo(Typ)(mV): 110; Eco-Plan: Green (RoHS & no Sb/Br); PartNumber: TPS79525DCQR; ComponentLink1Description: Manufacturer URL; ComponentLink2Description: Datasheet; DatasheetVersion: SLVS350H; ComponentLink3URL: http://www.ti.com/litv/pdf/mpds098c; Vout Adj(Max)(V): 2.5; ComponentLink1URL: http://www.ti.com/; Fixed Output Options(V): 2.5; ComponentLink2URL: http://www.ti.com/general/docs/lit/getliterature.tsp?genericPartNumber=TPS79525&fileType=pdf; PackageReference: DCQ0006A; ComponentLink3Description: Package Specification; PackageVersion: 4202109/D; Mounting Technology: Surface Mount; PackageDescription: 6-Pin Plastic Small Outline, Body 3.5 x 6.5 mm, Pitch 1.27 mm; Supplier 1: Mouser; Supplier 2: Digi-Key; Supplier 3: Arrow; Supplier Part Number 3: TPS79525DCQR; Supplier Part Number 2: 296-41778-6-ND; Supplier Part Number 1: 595-TPS79525DCQR
U6 = LDO_Microchip_MIC69502WR-TR_ADJ: LDO Voltage Regulators 5A Low VIN LDO Regulator with 0.5Vref; Supplier Part Number 1: 998-MIC69502WRTR; Supplier 1: Mouser
U7 = LDO_Analog_Devices_ADM7170ACPZ-2.5-R7_2.5V: LDO Voltage Regulators 0.5A Hi PSRR FT LDO 2.5V; Supplier Part Number 1: 584-ADM7170ACPZ2.5R7; Supplier 1: Mouser